# EAGLE design BaseStationV2 (EAGLE 5.07)
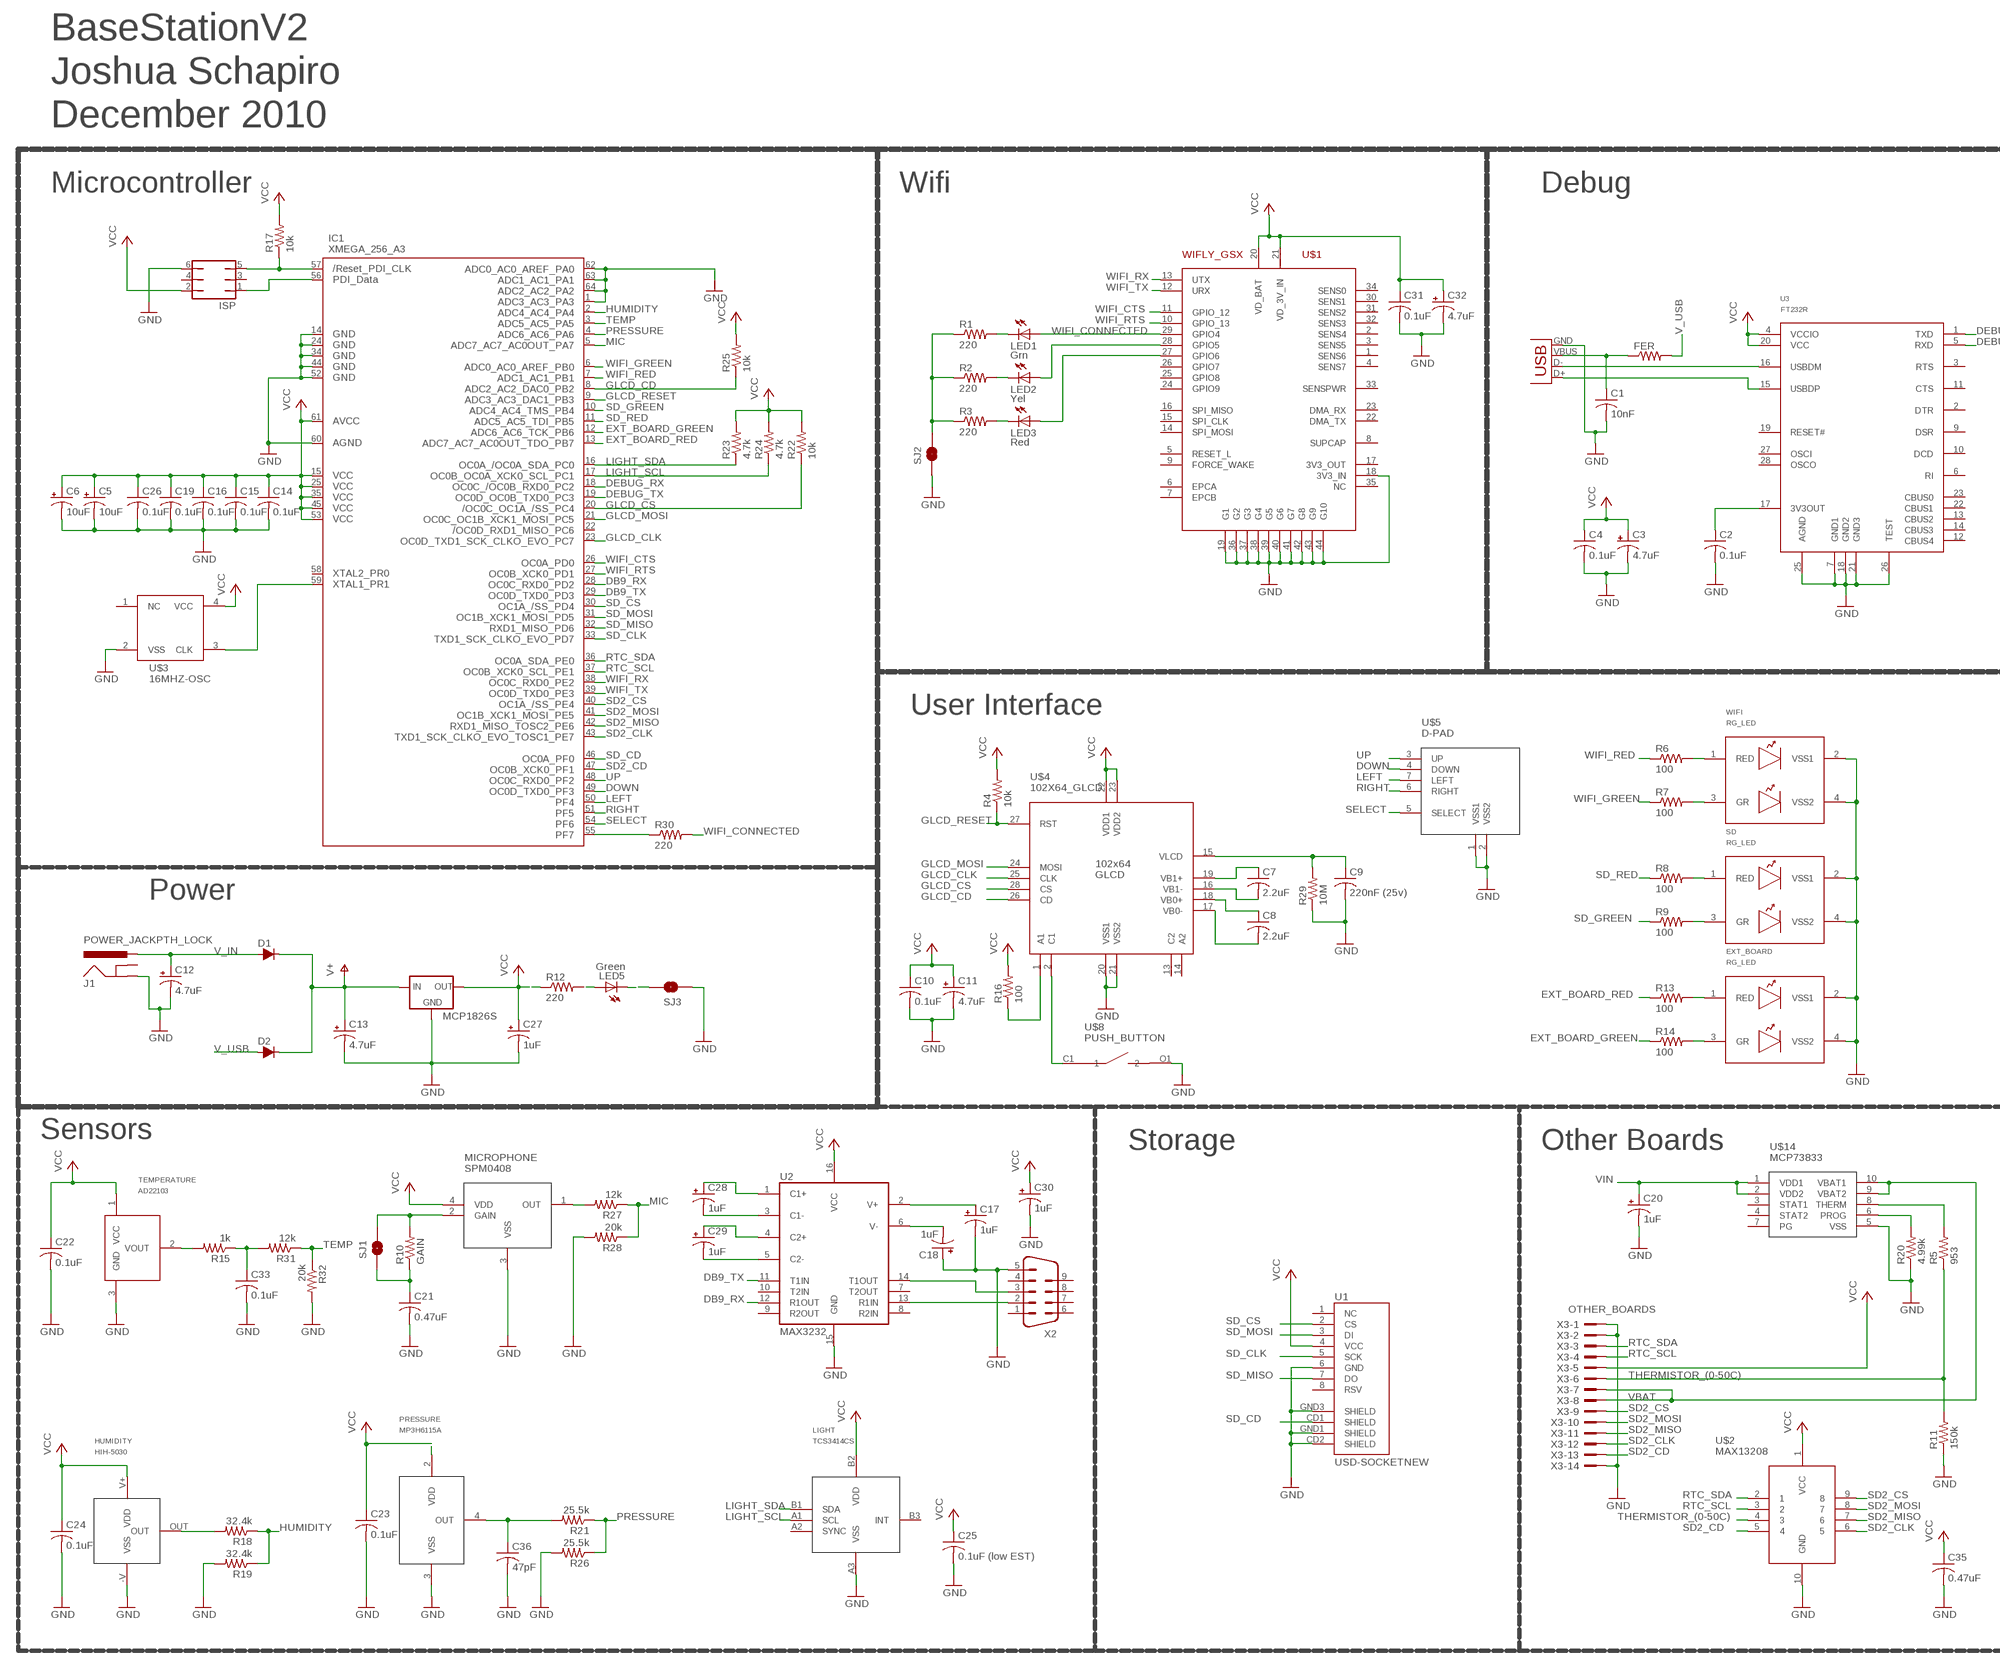
[diagram p0: schematic, sheet 1, part 1 of 2]
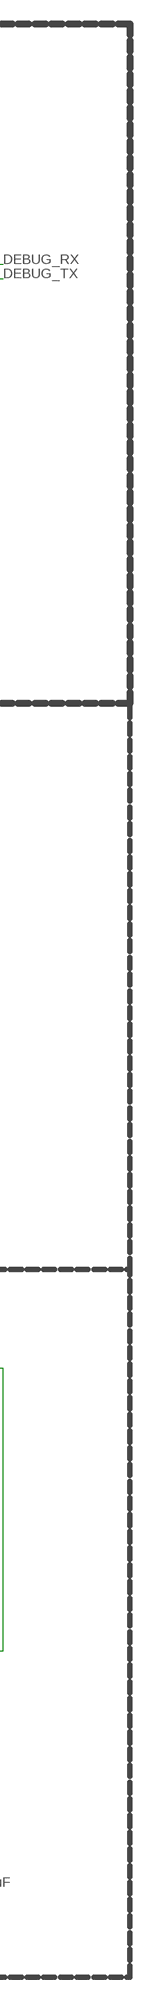
[diagram p1: schematic, sheet 1, part 2 of 2]

## Parts
C1  10nF  C-USC1206  [C1206]
C2  0.1uF  C-USC1206  [C1206]
C3  4.7uF  CPOL-USB  [PANASONIC_B]
C4  0.1uF  C-USC1206  [C1206]
C5  10uF  CPOL-USB  [PANASONIC_B]
C6  10uF  CPOL-USB  [PANASONIC_B]
C7  2.2uF  C-USC1206  [C1206]
C8  2.2uF  C-USC1206  [C1206]
C9  220nF (25v)  C-USC1206  [C1206]
C10  0.1uF  C-USC1206  [C1206]
C11  4.7uF  CPOL-USB  [PANASONIC_B]
C12  4.7uF  CPOL-USB  [PANASONIC_B]
C13  4.7uF  CPOL-USB  [PANASONIC_B]
C14  0.1uF  C-USC1206  [C1206]
C15  0.1uF  C-USC1206  [C1206]
C16  0.1uF  C-USC1206  [C1206]
C17  1uF  CPOL-USB  [PANASONIC_B]
C18  1uF  CPOL-USB  [PANASONIC_B]
C19  0.1uF  C-USC1206  [C1206]
C20  1uF  CPOL-USB  [PANASONIC_B]
C21  0.47uF  C-USC1206  [C1206]
C22  0.1uF  C-USC1206  [C1206]
C23  0.1uF  C-USC1206  [C1206]
C24  0.1uF  C-USC1206  [C1206]
C25  0.1uF (low EST)  C-USC1206  [C1206]
C26  0.1uF  C-USC1206  [C1206]
C27  1uF  CPOL-USB  [PANASONIC_B]
C28  1uF  CPOL-USB  [PANASONIC_B]
C29  1uF  CPOL-USB  [PANASONIC_B]
C30  1uF  CPOL-USB  [PANASONIC_B]
C31  0.1uF  C-USC1206  [C1206]
C32  4.7uF  CPOL-USB  [PANASONIC_B]
C33  0.1uF  C-USC1206  [C1206]
C35  0.47uF  C-USC1206  [C1206]
C36  47pF  C-USC1206  [C1206]
D1  D-FILL-SMB  [SMB]
D2  D-FILL-SMB  [SMB]
EXT_BOARD  RG_LED  [RG_LED]
FER  R-US_R0805  [R0805]
HUMIDITY  HIH-5030  [HIH-5030]
IC1  XMEGA_256_A3  AVR_XMEGA_A3_  [TQFP64]
ISP  JP3Q  [JP3Q]
J1  POWER_JACKPTH_LOCK  [POWER_JACK_PTH_LOCK]
LED1  Grn  LEDCHIPLED_1206  [CHIPLED_1206]
LED2  Yel  LEDCHIPLED_1206  [CHIPLED_1206]
LED3  Red  LEDCHIPLED_1206  [CHIPLED_1206]
LED5  Green  LEDCHIPLED_1206  [CHIPLED_1206]
LIGHT  TCS3414CS  [2X3BGA]
MCP1826S  78XXL  [78XXL]
MICROPHONE  SPM0408  [SPM0408]
PRESSURE  MP3H6115A  [1317-04]
R1  220  R-US_R1206  [R1206]
R2  220  R-US_R1206  [R1206]
R3  220  R-US_R1206  [R1206]
R4  10k  R-US_R1206  [R1206]
R5  953  R-US_R1206  [R1206]
R6  100  R-US_R1206  [R1206]
R7  100  R-US_R1206  [R1206]
R8  100  R-US_R1206  [R1206]
R9  100  R-US_R1206  [R1206]
R10  GAIN  R-US_R1206  [R1206]
R11  150k  R-US_R1206  [R1206]
R12  220  R-US_R1206  [R1206]
R13  100  R-US_R1206  [R1206]
R14  100  R-US_R1206  [R1206]
R15  1k  R-US_R1206  [R1206]
R16  100  R-US_R1206  [R1206]
R17  10k  R-US_R1206  [R1206]
R18  32.4k  R-US_R1206  [R1206]
R19  32.4k  R-US_R1206  [R1206]
R20  4.99k  R-US_R1206  [R1206]
R21  25.5k  R-US_R1206  [R1206]
R22  10k  R-US_R1206  [R1206]
R23  4.7k  R-US_R1206  [R1206]
R24  4.7k  R-US_R1206  [R1206]
R25  10k  R-US_R1206  [R1206]
R26  25.5k  R-US_R1206  [R1206]
R27  12k  R-US_R1206  [R1206]
R28  20k  R-US_R1206  [R1206]
R29  10M  R-US_R1206  [R1206]
R30  220  R-US_R1206  [R1206]
R31  12k  R-US_R1206  [R1206]
R32  20k  R-US_R1206  [R1206]
SD  RG_LED  [RG_LED]
SJ1  SOLDERJUMPERNC2  [SJ_2S-NOTRACE]
SJ2  SOLDERJUMPERNO  [SJ_2S-NO]
SJ3  SOLDERJUMPERNO  [SJ_2S-NO]
TEMPERATURE  AD22103  [TO-92]
U1  USD-SOCKETNEW  [MICRO-SD-SOCKET-PP]
U2  MAX3232  MAX232SOIC16  [SO016]
U3  FT232R  [SSOP28]
U$1  WIFLY_GSX  [WIFLY_GSX]
U$2  MAX13208  [10-UDFN]
U$3  16MHZ-OSC  [4-SMD]
U$4  102X64_GLCD  [102X64_GLCD]
U$5  D-PAD  [D-PAD]
U$8  PUSH_BUTTON  [DR6]
U$14  MCP73833  [10-MSOP]
WIFI  RG_LED  [RG_LED]
X1  USBPTH  [USB-B-PTH]
X2  M09HP  [M09HP]
X3  OTHER_BOARDS  2514-  [PAK100/2500-14]

## Nets
DB9_RX: IC1.28(PD2) U2.12(R1OUT)
DB9_TX: IC1.29(PD3) U2.11(T1IN)
DEBUG_RX: IC1.18(PC2) U3.1(TXD)
DEBUG_TX: IC1.19(PC3) U3.5(RXD)
DOWN: IC1.49(PF3) U$5.4(DOWN)
EXT_BOARD_GREEN: IC1.12(PB6) R14.1
EXT_BOARD_RED: IC1.13(PB7) R13.1
GLCD_CD: IC1.8(PB2) R25.1 U$4.26(CD)
GLCD_CLK: IC1.23(PC7) U$4.25(CLK)
GLCD_CS: IC1.20(PC4) R22.1 U$4.28(CS)
GLCD_MOSI: IC1.21(PC5) U$4.24(MOSI)
GLCD_RESET: IC1.9(PB3) R4.1 U$4.27(RST)
GND: C1.2 C2.2 C3.- C4.2 C5.- C6.- C9.2 C10.2 C11.- C12.- C13.- C14.2 C15.2 C16.2 C17.- C18.+ C19.2 C20.- C21.2 C22.2 C23.2 C24.2 C25.2 C26.2 C27.- C30.- C31.2 C32.- C33.2 C35.2 C36.2 EXT_BOARD.2(VSS1) EXT_BOARD.4(VSS2) HUMIDITY.-V(VSS) IC1.1(PA3) IC1.14(GND1) IC1.24(GND2) IC1.34(GND3) IC1.44(GND4) IC1.52(GND5) IC1.60(AGND) IC1.62(PA0) IC1.63(PA1) IC1.64(PA2) ISP.6 J1.GND LIGHT.A3(VSS) MCP1826S.GND MICROPHONE.3(VSS) PRESSURE.3(VSS) R11.1 R19.2 R20.1 R26.2 R28.2 R29.1 R32.2 SD.2(VSS1) SD.4(VSS2) SJ2.1 SJ3.1 TEMPERATURE.3(GND) U1.6(GND) U1.CD2(SHIELD) U1.GND1(SHIELD) U1.GND3(SHIELD) U2.15(GND) U3.7(GND1) U3.18(GND2) U3.21(GND3) U3.25(AGND) U3.26(TEST) U$1.18(3V3_IN) U$1.19(G1) U$1.36(G2) U$1.37(G3) U$1.38(G4) U$1.39(G5) U$1.40(G6) U$1.41(G7) U$1.42(G8) U$1.43(G9) U$1.44(G10) U$2.10(GND) U$3.2(VSS) U$4.20(VSS1) U$4.21(VSS2) U$5.1(VSS1) U$5.2(VSS2) U$8.O1 U$14.5(VSS) WIFI.2(VSS1) WIFI.4(VSS2) X1.GND X2.5 X3.1 X3.2 X3.14
HUMIDITY: IC1.2(PA4) R18.1 R19.1
LEFT: IC1.50(PF4) U$5.7(LEFT)
LIGHT_SCL: IC1.17(PC1) LIGHT.A1(SCL) R24.1
LIGHT_SDA: IC1.16(PC0) LIGHT.B1(SDA) R23.1
MIC: IC1.5(PA7) R27.1 R28.1
N$1: IC1.57(RESET) ISP.5 R17.1
N$2: IC1.56(PDI_DATA) ISP.1
N$3: LED2.A U$1.28(GPIO5)
N$4: IC1.55(PF7) R30.1
N$5: LED3.A U$1.27(GPIO6)
N$6: LED1.C R1.2
N$7: LED2.C R2.2
N$8: LED3.C R3.2
N$9: IC1.59(PR1) U$3.3(CLK)
N$10: C1.1 FER.1 X1.VBUS
N$12: U3.16(USBDM) X1.D-
N$13: U3.15(USBDP) X1.D+
N$14: C7.1 U$4.19(VB1+)
N$15: C7.2 U$4.16(VB1-)
N$16: EXT_BOARD.1(RED) R13.2
N$17: EXT_BOARD.3(GR) R14.2
N$18: C2.1 U3.17(3V3OUT)
N$19: C17.+ U2.2(V+)
N$20: U2.14(T1OUT) X2.3
N$21: C8.1 U$4.18(VB0+)
N$22: C8.2 U$4.17(VB0-)
N$23: C9.1 R29.2 U$4.15(VLCD)
N$24: C33.1 R15.1 R31.2
N$25: R5.2 U$14.8(THERM)
N$26: R8.2 SD.1(RED)
N$27: R6.2 WIFI.1(RED)
N$28: R7.2 WIFI.3(GR)
N$29: U2.13(R1IN) X2.2
N$30: R9.2 SD.3(GR)
N$31: C18.- U2.6(V-)
N$32: C21.1 R10.1 SJ1.1
N$33: MICROPHONE.2(GAIN) R10.2 SJ1.2
N$34: R1.1 R2.1 R3.1 SJ2.2
N$35: LED5.C SJ3.2
N$36: R15.2 TEMPERATURE.2(VOUT)
N$37: LED5.A R12.2
N$38: HUMIDITY.OUT R18.2
N$39: R16.1 U$4.1(A1)
N$40: C36.1 PRESSURE.4(OUT) R21.2
N$41: C28.+ U2.1(C1+)
N$42: C28.- U2.3(C1-)
N$43: C29.+ U2.4(C2+)
N$44: U$4.2(C1) U$8.C1
N$47: MICROPHONE.1(OUT) R27.2
N$49: C29.- U2.5(C2-)
N$51: R20.2 U$14.6(PROG)
PRESSURE: IC1.4(PA6) R21.1 R26.1
RIGHT: IC1.51(PF5) U$5.6(RIGHT)
RTC_SCL: IC1.37(PE1) U$2.3 X3.4
RTC_SDA: IC1.36(PE0) U$2.2 X3.3
SD2_CD: IC1.47(PF1) U$2.5 X3.13
SD2_CLK: IC1.43(PE7) U$2.6 X3.12
SD2_CS: IC1.40(PE4) U$2.9 X3.9
SD2_MISO: IC1.42(PE6) U$2.7 X3.11
SD2_MOSI: IC1.41(PE5) U$2.8 X3.10
SD_CD: IC1.46(PF0) U1.CD1(SHIELD)
SD_CLK: IC1.33(PD7) U1.5(SCK)
SD_CS: IC1.30(PD4) U1.2(CS)
SD_GREEN: IC1.10(PB4) R9.1
SD_MISO: IC1.32(PD6) U1.7(DO)
SD_MOSI: IC1.31(PD5) U1.3(DI)
SD_RED: IC1.11(PB5) R8.1
SELECT: IC1.54(PF6) U$5.5(SELECT)
TEMP: IC1.3(PA5) R31.1 R32.1
THERMISTOR_(0-50C): R5.1 R11.2 U$2.4 X3.6
UP: IC1.48(PF2) U$5.3(UP)
V+: C13.+ D1.1(C) D2.1(C) MCP1826S.IN
V_IN: C12.+ D1.2(A) J1.PWR
V_USB: D2.2(A) FER.2
VBAT: U$14.9(VBAT2) U$14.10(VBAT1) X3.7 X3.8
VCC: C3.+ C4.1 C5.+ C6.+ C10.1 C11.+ C14.1 C15.1 C16.1 C19.1 C22.1 C23.1 C24.1 C25.1 C26.1 C27.+ C30.+ C31.1 C32.+ C35.1 HUMIDITY.V+(VDD) IC1.15(VCC1) IC1.25(VCC2) IC1.35(VCC3) IC1.45(VCC4) IC1.53(VCC5) IC1.61(AVCC) ISP.2 LIGHT.B2(VDD) MCP1826S.OUT MICROPHONE.4(VDD) PRESSURE.2(VDD) R4.2 R12.1 R16.2 R17.2 R22.2 R23.2 R24.2 R25.2 TEMPERATURE.1(VCC) U1.4(VCC) U2.16(VCC) U3.4(VCCIO) U3.20(VCC) U$1.20(VD_BAT) U$1.21(VD_3V_IN) U$2.1(VCC) U$3.4(VCC) U$4.22(VDD1) U$4.23(VDD2) X3.5
VIN: C20.+ U$14.1(VDD1) U$14.2(VDD2)
WIFI_CONNECTED: LED1.A R30.2 U$1.29(GPIO4)
WIFI_CTS: IC1.26(PD0) U$1.11(GPIO_12)
WIFI_GREEN: IC1.6(PB0) R7.1
WIFI_RED: IC1.7(PB1) R6.1
WIFI_RTS: IC1.27(PD1) U$1.10(GPIO_13)
WIFI_RX: IC1.38(PE2) U$1.13(UTX)
WIFI_TX: IC1.39(PE3) U$1.12(URX)
Unconnected: IC1.22(PC6) IC1.58(PR0) ISP.3 ISP.4 J1.GNDBREAK LIGHT.A2(SYNC) LIGHT.B3(INT) U1.1(NC) U1.8(RSV) U2.7(T2OUT) U2.8(R2IN) U2.9(R2OUT) U2.10(T2IN) U3.2(DTR) U3.3(RTS) U3.6(RI) U3.9(DSR) U3.10(DCD) U3.11(CTS) U3.12(CBUS4) U3.13(CBUS2) U3.14(CBUS3) U3.19(RESET#) U3.22(CBUS1) U3.23(CBUS0) U3.27(OSCI) U3.28(OSCO) U$1.1(SENS6) U$1.2(SENS4) U$1.3(SENS5) U$1.4(SENS7) U$1.5(RESET_L) U$1.6(EPCA) U$1.7(EPCB) U$1.8(SUPCAP) U$1.9(FORCE_WAKE) U$1.14(SPI_MOSI) U$1.15(SPI_CLK) U$1.16(SPI_MISO) U$1.17(3V3_OUT) U$1.22(DMA_TX) U$1.23(DMA_RX) U$1.24(GPIO9) U$1.25(GPIO8) U$1.26(GPIO7) U$1.30(SENS1) U$1.31(SENS2) U$1.32(SENS3) U$1.33(SENSPWR) U$1.34(SENS0) U$1.35(NC) U$3.1(NC) U$4.13(C2) U$4.14(A2) U$14.3(STAT1) U$14.4(STAT2) U$14.7(PG) X2.1 X2.4 X2.6 X2.7 X2.8 X2.9

## Notes on the sheet
- BaseStationV2
- Joshua Schapiro
- December 2010
- Microcontroller | Wifi | Debug
- User Interface
- Power
- Sensors
- Storage | Other Boards

## Library data of the parts
C1 C2 C4 C7-C10 C14-C16 C19 C21-C26 C31 C33 C35 C36 = resistor:C-US: CAPACITOR, American symbol
C3 C5 C6 C11-C13 C27 C32 = gadgetry:CPOL-US: POLARIZED CAPACITOR, American symbol
C17 C18 C20 C28-C30 = resistor:CPOL-US: POLARIZED CAPACITOR, American symbol
D1 D2 = semicon-smd-ipc:D-FILL-: DIODE filled
EXT_BOARD SD WIFI = Josh:RG_LED
FER R1-R32 = resistor:R-US_: RESISTOR, American symbol
HUMIDITY = Josh:HIH-5030
IC1 = xmega:AVR_XMEGA_A3_: Device for Atmel AVR XMEGA A3 Series
ISP = jumper:JP3Q: JUMPER
J1 = SparkFun:POWER_JACK: Power Jack This is the standard 5.5mm barrel jack for power. The PTH is the most common, proven, reliable, footprint. All others are experimental. The Slot footprint only works if the mill layer is transmitted to the PCB fab house so be warned. Spark Fun Electronics SKU : PRT-00119. Mating wall wart : TOL-00298 (and others)
LED1-LED3 LED5 = led:LED: LED OSRAM: - CHIPLED LG R971, LG N971, LY N971, LG Q971, LY Q971, LO R971, LY R971 LH N974, LH R974 LS Q976, LO Q976, LY Q976 LO Q996 - Hyper CHIPLED LW Q18S LB Q993, LB Q99A, LB R99A - SideLED LS A670, LO A670, LY A670, LG A670, LP A670 LB A673, LV A673, LT A673, LW A673 LH A674 LY A675 LS A676, LA A676, LO A676, LY A676, LW A676 LS A679, LY A679, LG A679 - Hyper Micro SIDELED® LS Y876, LA Y876, LO Y876, LY Y876 LT Y87S - SmartLED LW L88C, LW L88S LB L89C, LB L89S, LG L890 LS L89K, LO L89K, LY L89K LS L896, LA L896, LO L896, LY L896 - TOPLED LS T670, LO T670, LY T670, LG T670, LP T670 LSG T670, LSP T670, LSY T670, LOP T670, LYG T670 LG T671, LOG T671, LSG T671 LB T673, LV T673, LT T673, LW T673 LH T674 LS T676, LA T676, LO T676, LY T676, LB T676, LH T676, LSB T676, LW T676 LB T67C, LV T67C, LT T67C, LS T67K, LO T67K, LY T67K, LW E67C LS E67B, LA E67B, LO E67B, LY E67B, LB E67C, LV E67C, LT E67C LW T67C LS T679, LY T679, LG T679 LS T770, LO T770, LY T770, LG T770, LP T770 LB T773, LV T773, LT T773, LW T773 LH T774 LS E675, LA E675, LY E675, LS T675 LS T776, LA T776, LO T776, LY T776, LB T776 LHGB T686 LT T68C, LB T68C - Hyper Mini TOPLED® LB M676 - Mini TOPLED Santana® LG M470 LS M47K, LO M47K, LY M47K Source: http://www.osram.convergy.de - LUMILED® LXK2-PW12-R00, LXK2-PW12-S00, LXK2-PW14-U00, LXK2-PW14-V00 LXK2-PM12-R00, LXK2-PM12-S00, LXK2-PM14-U00 LXK2-PE12-Q00, LXK2-PE12-R00, LXK2-PE12-S00, LXK2-PE14-T00, LXK2-PE14-U00 LXK2-PB12-K00, LXK2-PB12-L00, LXK2-PB12-M00, LXK2-PB14-N00, LXK2-PB14-P00, LXK2-PB14-Q00 LXK2-PR12-L00, LXK2-PR12-M00, LXK2-PR14-Q00, LXK2-PR14-R00 LXK2-PD12-Q00, LXK2-PD12-R00, LXK2-PD12-S00 LXK2-PH12-R00, LXK2-PH12-S00 LXK2-PL12-P00, LXK2-PL12-Q00, LXK2-PL12-R00 Source: www.luxeon.com
LIGHT = Josh:TCS3414CS
MCP1826S = v-reg:78XXL: VOLTAGE REGULATOR
MICROPHONE = Josh:SPM0408
PRESSURE = Josh:MP3H6115A
SJ1-SJ3 = SparkFun:SOLDERJUMPER: Solder Jumper Standard SMD solder jumper. Used to automate production. Two varients : Normally Open and Normally Closed are the same, but have different paste layers. NC will have a large amount of paste and should jumper during reflow.
TEMPERATURE = Josh:AD22103
U1 = SparkFun:USD-SOCKET: microSD Socket Push-push type uSD socket. Schematic element and footprint production proven. Spark Fun Electronics SKU : PRT-00127. tDoc lines correctly indicate media card edge positions when inserting (unlocked, locked, depressed).
U2 = SparkFun:MAX232: RS232 Transceiver Very common IC. This is generically called 'MAX232', but works with the 3V equivalent MAX3232 generic ICs. Field tested and mother approved. Spark Fun Electronics SKU : COM-00316 (DIP) and COM-00589 (SMD)
U3 = gadgetry:FT232R
U$1 = SparkFun:WIFLY_GSX
U$2 = Josh:MAX13208
U$3 = Josh:16MHZ-OSC
U$4 = Josh:102X64_GLCD
U$5 = Josh:D-PAD
U$8 = Josh:PUSH_BUTTON: digikey: 401-1995-ND
U$14 = Josh:MCP73833
X1 = SparkFun:USB: USB Connectors USB-B-PTH is fully proven SKU : PRT-00139 USB-miniB is fully proven SKU : PRT-00587 USB-A-PCB is untested. USB-A-H is throughly reviewed, but untested. Spark Fun Electronics SKU : PRT-00437 USB-B-SMT is throughly reviewed, but untested. Needs silkscreen touching up. USB-A-S has not been used/tested USB-MB-H has not been used/tested
X2 = con-subd:M09: SUB-D
X3 = con-3m:2514-: 3M (TM) Pak 100 4-Wall Header Source: 3M

## Board
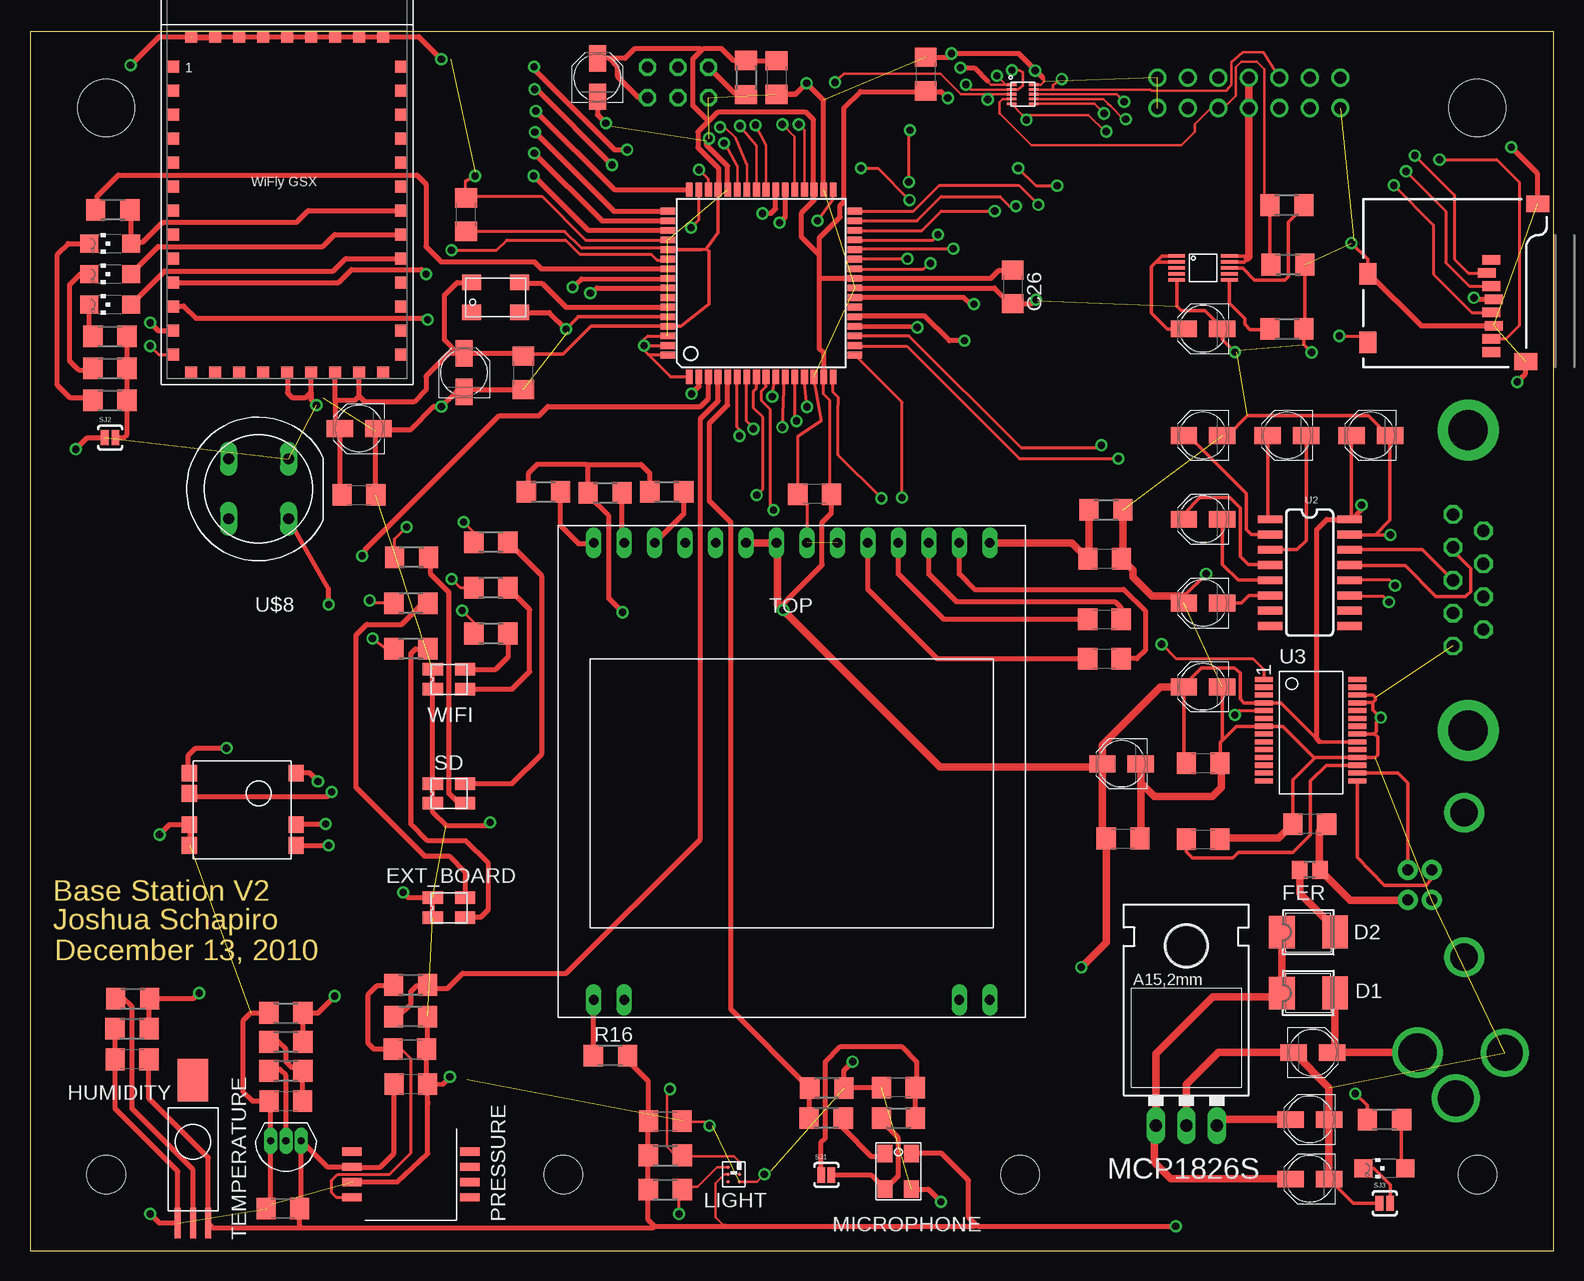
[diagram p2: board, top side]
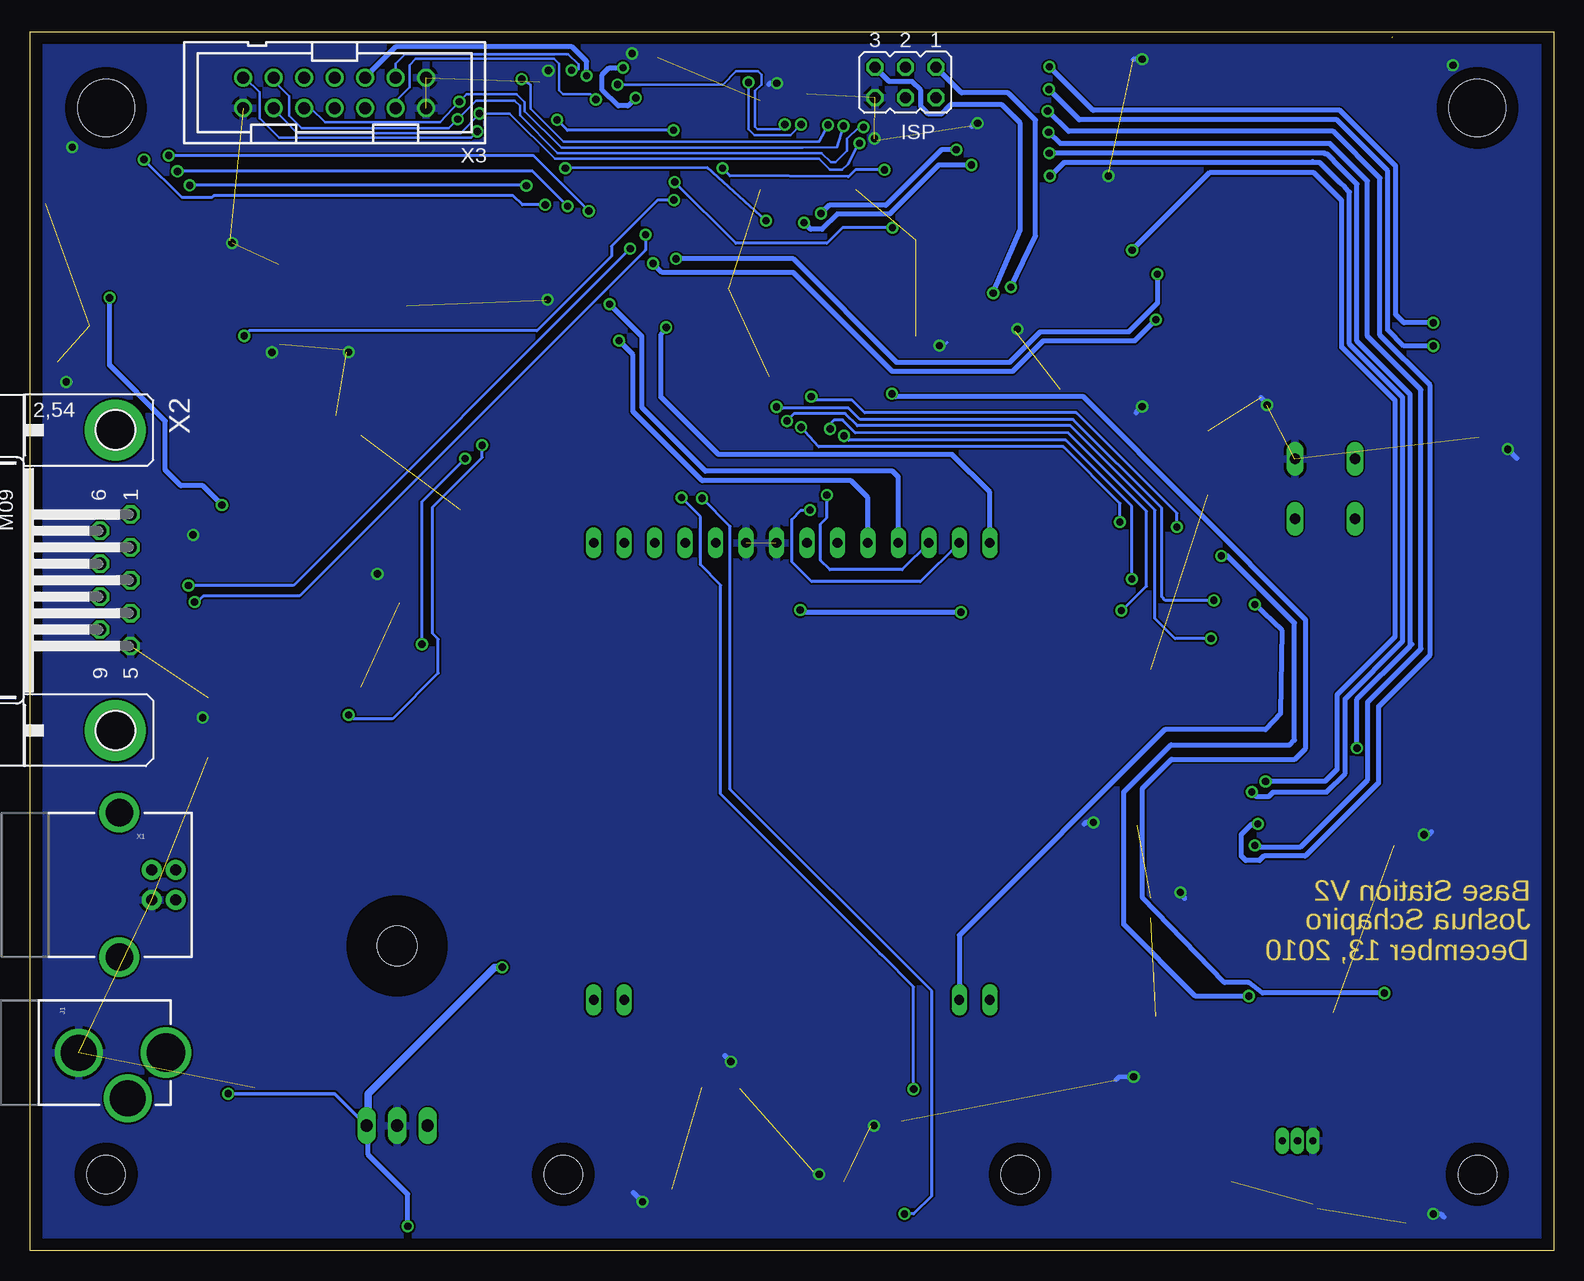
[diagram p3: board, bottom side, seen from below]

Size 127 x 101.6 mm. Coordinates in mm from the lower left corner, seen from the top.
Outline: 0,0 127,0 127,101.6 0,101.6 0,0
Copper layers (1*16): Top 0.035mm / dielectric 1.5mm / Bottom 0.035mm
Design rules "default *": minimum track width 6mil, minimum drill 15mil, track to track 6mil, track to pad 6mil, pad to pad 6mil, via to via 6mil, smd to smd 6mil, copper to edge 40mil, drill to drill 8mil, minimum pad ring 10mil, minimum via ring 8mil, stop-mask expansion 4mil, vias tented up to drill 0mil, thermal gap 10mil
Holes 3.2 mm at 6.35,6.35 120.65,6.35 82.55,6.35 44.45,6.35
Holes 4.76 mm at 6.35,95.25 120.65,95.25

### Footprints (pad centres in the part's own frame; a part is rotated, then mirrored left to right if it is on the bottom)
C1206 = smd 1.6 x 1.8: 1 -1.4,0; 2 1.4,0
PANASONIC_B = smd 2.2 x 1.4: + 1.6,0; - -1.6,0
SMB = smd 2.159 x 2.743: 1 -2.311,-0.127; 2 2.108,-0.102
RG_LED = smd 1.699 x 1.041: 1 1.35,0.825; 2 -1.35,0.825; 3 1.35,-0.825; 4 -1.35,-0.825
R0805 = smd 1.3 x 1.5: 1 -0.85,0; 2 0.85,0
HIH-5030 = smd 0.508 x 2.54: -V -1.27,-5.334; OUT 0,-5.334; V+ 1.27,-5.334 | smd 2.54 x 3.556: NC 0,6.604
TQFP64 = smd 1.194 x 0.559: 1 -7.8,6; 2 -7.8,5.2; 3 -7.8,4.4; 4 -7.8,3.6; 5 -7.8,2.8; 6 -7.8,2; 7 -7.8,1.2; 8 -7.8,0.4; 9 -7.8,-0.4; 10 -7.8,-1.2; 11 -7.8,-2; 12 -7.8,-2.8; 13 -7.8,-3.6; 14 -7.8,-4.4; 15 -7.8,-5.2; 16 -7.8,-6; 33 7.8,-6; 34 7.8,-5.2; 35 7.8,-4.4; 36 7.8,-3.6; 37 7.8,-2.8; 38 7.8,-2; 39 7.8,-1.2; 40 7.8,-0.4; 41 7.8,0.4; 42 7.8,1.2; 43 7.8,2; 44 7.8,2.8; 45 7.8,3.6; 46 7.8,4.4; 47 7.8,5.2; 48 7.8,6 | smd 0.559 x 1.194: 17 -6,-7.8; 18 -5.2,-7.8; 19 -4.4,-7.8; 20 -3.6,-7.8; 21 -2.8,-7.8; 22 -2,-7.8; 23 -1.2,-7.8; 24 -0.4,-7.8; 25 0.4,-7.8; 26 1.2,-7.8; 27 2,-7.8; 28 2.8,-7.8; 29 3.6,-7.8; 30 4.4,-7.8; 31 5.2,-7.8; 32 6,-7.8; 49 6,7.8; 50 5.2,7.8; 51 4.4,7.8; 52 3.6,7.8; 53 2.8,7.8; 54 2,7.8; 55 1.2,7.8; 56 0.4,7.8; 57 -0.4,7.8; 58 -1.2,7.8; 59 -2,7.8; 60 -2.8,7.8; 61 -3.6,7.8; 62 -4.4,7.8; 63 -5.2,7.8; 64 -6,7.8
JP3Q = drill 0.914 octagon: 1 -2.54,-1.27; 2 -2.54,1.27; 3 0,-1.27; 4 0,1.27; 5 2.54,-1.27; 6 2.54,1.27
POWER_JACK_PTH_LOCK = drill 2.997 round: GND 0.025,6.608; GNDBREAK 3.812,10.7 | drill 3.2 round: PWR 0,13.878
CHIPLED_1206 = smd 1.5 x 1.5: A 0,-1.75; C 0,1.75
2X3BGA = smd 0.3 x 0.3: A1 -0.61,0.475; A2 0,0.475; A3 0.61,0.475; B1 -0.61,-0.475; B2 0,-0.475; B3 0.61,-0.475
78XXL = drill 1.016 long: GND 0,-3.81; IN -2.54,-3.81; OUT 2.54,-3.81 | hole 3.302: 0,11.176
SPM0408 = smd 1.245 x 1.448: 1 -1.105,1.486; 2 -1.105,-1.486; 3 1.105,-1.486; 4 1.105,1.486
1317-04 = smd 1.6 x 0.686: 1 -4.915,1.905; 2 -4.915,0.635; 3 -4.915,-0.635; 4 -4.915,-1.905; 5 4.915,-1.905; 6 4.915,-0.635; 7 4.915,0.635; 8 4.915,1.905
R1206 = smd 1.6 x 1.803: 1 -1.422,0; 2 1.422,0
SJ_2S-NOTRACE = smd 0.635 x 1.27: 1 -0.45,0; 2 0.4,0
SJ_2S-NO = smd 0.635 x 1.27: 1 -0.45,0; 2 0.45,0
TO-92 = drill 0.6 long: 1 -1.27,0; 2 0,0; 3 1.27,0
MICRO-SD-SOCKET-PP = smd 0.8 x 1.5: 1 -8.94,10.7; 2 -7.84,10.3; 3 -6.74,10.7; 4 -5.64,10.9; 5 -4.54,10.7; 6 -3.44,10.9; 7 -2.34,10.7; 8 -1.24,10.7 | smd 1.8 x 1.4: CD1 -2.05,0.4; CD2 -7.75,0.4 | smd 1.4 x 1.9: GND1 -13.6,14.55; GND3 -0.45,13.55
SO016 = smd 0.66 x 2.032: 1 -4.445,-3.315; 2 -3.175,-3.315; 3 -1.905,-3.315; 4 -0.635,-3.315; 5 0.635,-3.315; 6 1.905,-3.315; 7 3.175,-3.315; 8 4.445,-3.315; 9 4.445,3.315; 10 3.175,3.315; 11 1.905,3.315; 12 0.635,3.315; 13 -0.635,3.315; 14 -1.905,3.315; 15 -3.175,3.315; 16 -4.445,3.315
SSOP28 = smd 0.425 x 1.5: 1 0.65,-1.3; 2 1.3,-1.3; 3 1.95,-1.3; 4 2.6,-1.3; 5 3.25,-1.3; 6 3.9,-1.3; 7 4.55,-1.3; 8 5.2,-1.3; 9 5.85,-1.3; 10 6.5,-1.3; 11 7.15,-1.3; 12 7.8,-1.3; 13 8.45,-1.3; 14 9.1,-1.3; 15 9.1,6.5; 16 8.45,6.5; 17 7.8,6.5; 18 7.15,6.5; 19 6.5,6.5; 20 5.85,6.5; 21 5.2,6.5; 22 4.55,6.5; 23 3.9,6.5; 24 3.25,6.5; 25 2.6,6.5; 26 1.95,6.5; 27 1.3,6.5; 28 0.65,6.5
WIFLY_GSX = smd 1 x 1: 1 0.5,26; 2 0.5,24; 3 0.5,22; 4 0.5,20; 5 0.5,18; 6 0.5,16; 7 0.5,14; 8 0.5,12; 9 0.5,10; 10 0.5,8; 11 0.5,6; 12 0.5,4; 13 0.5,2; 14 2,0.5; 15 4,0.5; 16 6,0.5; 17 8,0.5; 18 10,0.5; 19 12,0.5; 20 14,0.5; 21 16,0.5; 22 18,0.5; 23 19.5,2; 24 19.5,4; 25 19.5,6; 26 19.5,8; 27 19.5,10; 28 19.5,12; 29 19.5,14; 30 19.5,16; 31 19.5,18; 32 19.5,20; 33 19.5,22; 34 19.5,24; 35 19.5,26; 36 18,28.5; 37 16,28.5; 38 14,28.5; 39 12,28.5; 40 10,28.5; 41 8,28.5; 42 6,28.5; 43 4,28.5; 44 2,28.5
10-UDFN = smd 0.8 x 0.22: 1 -0.91,0.8; 2 -0.91,0.4; 3 -0.91,0; 4 -0.91,-0.4; 5 -0.91,-0.8; 6 0.91,-0.8; 7 0.91,-0.4; 8 0.91,0; 9 0.91,0.4; 10 0.91,0.8
4-SMD = smd 1.6 x 1.3: 1 -2,-1.25; 2 2,-1.25; 3 2,1.25; 4 -2,1.25
102X64_GLCD = drill 0.8 long: 1 -16.51,-17.2; 2 -13.97,-17.2; 13 13.97,-17.2; 14 16.51,-17.2; 15 16.51,20.9; 16 13.97,20.9; 17 11.43,20.9; 18 8.89,20.9; 19 6.35,20.9; 20 3.81,20.9; 21 1.27,20.9; 22 -1.27,20.9; 23 -3.81,20.9; 24 -6.35,20.9; 25 -8.89,20.9; 26 -11.43,20.9; 27 -13.97,20.9; 28 -16.51,20.9
D-PAD = smd 1.27 x 1.397: 1 -5.757,-4.318; 2 -5.757,-2.591; 3 3.141,-2.591; 4 3.141,-4.318; 5 3.141,1.702; 6 -5.757,0; 7 -5.757,1.702
DR6 = drill 0.9 long: C1 -2.5,2.5; C2 2.5,2.5; O1 -2.5,-2.5; O2 2.5,-2.5
10-MSOP = smd 0.3 x 1.4: 1 -1,-2.2; 2 -0.5,-2.2; 3 0,-2.2; 4 0.5,-2.2; 5 1,-2.2; 6 1,2.2; 7 0.5,2.2; 8 0,2.2; 9 -0.5,2.2; 10 -1,2.2
USB-B-PTH = drill 0.914 pad 1.676 round: D+ 0,1.25; D- 1.981,1.25; GND 0,-1.25; VBUS 1.981,-1.25 | drill 2.286 round: P$1 -2.718,-6.02; P$2 -2.718,6.02
M09HP = drill 1.016 octagon: 1 -5.486,1.27; 2 -2.743,1.27; 3 0,1.27; 4 2.743,1.27; 5 5.486,1.27; 6 -4.115,-1.27; 7 -1.372,-1.27; 8 1.372,-1.27; 9 4.115,-1.27 | drill 3.302 pad 5.08 round: G1 -12.522,0; G2 12.522,0
PAK100/2500-14 = drill 1 pad 1.422 round: 1 -7.62,-1.27; 2 -7.62,1.27; 3 -5.08,-1.27; 4 -5.08,1.27; 5 -2.54,-1.27; 6 -2.54,1.27; 7 0,-1.27; 8 0,1.27; 9 2.54,-1.27; 10 2.54,1.27; 11 5.08,-1.27; 12 5.08,1.27; 13 7.62,-1.27; 14 7.62,1.27

### Placement (x,y rotation side)
C1  106.68,35.56 180 top
C2  97.79,34.29 0 top
C3  97.79,46.99 180 top
C4  97.79,40.64 0 top
C5  36.2,73.18 90 top
C6  47.31,97.79 90 top
C7  89.56,49.35 0 top
C8  89.56,52.63 0 top
C9  89.59,57.68 0 top
C10  91.11,34.35 0 top
C11  91,40.58 180 top
C12  106.93,16.51 0 top
C13  106.68,5.97 180 top
C14  65.41,63.06 180 top
C15  41.11,73.17 270 top
C16  36.35,86.36 90 top
C17  97.79,67.94 180 top
C18  97.79,53.98 180 top
C19  62.23,97.78 270 top
C20  97.79,76.83 180 top
C21  72.39,13.59 180 top
C22  21.08,3.49 180 top
C23  31.75,13.89 0 top
C24  8.51,15.94 180 top
C25  52.96,10.79 0 top
C26  81.92,80.33 270 top
C27  106.68,10.92 180 top
C28  104.78,67.94 180 top
C29  97.79,60.96 180 top
C30  111.76,67.94 180 top
C31  27.43,62.99 0 top
C32  27.43,68.52 180 top
C33  21.34,12.45 180 top
C35  74.68,98.07 90 top
C36  31.67,16.79 0 top
D1  106.68,21.59 0 top
D2  106.68,26.67 0 top
EXT_BOARD  34.92,28.57 0 top
FER  106.68,31.75 180 top
HUMIDITY  13.59,7.62 0 top
IC1  60.96,80.64 90 top
ISP  54.03,97.38 180 bottom
J1  129.54,16.51 270 bottom
LED1  6.67,83.95 90 top
LED2  6.67,81.41 90 top
LED3  6.67,78.87 90 top
LED5  112.9,6.86 90 top
LIGHT  58.67,6.35 270 top
MCP1826S  96.39,14.22 0 top
MICROPHONE  72.39,6.6 0 top
PRESSURE  31.75,6.35 0 top
R1  6.67,70.87 180 top
R2  6.67,73.53 180 top
R3  6.67,76.2 180 top
R4  47.94,63.18 180 top
R5  104.78,87.15 0 top
R6  38.42,51.44 0 top
R7  38.42,55.24 0 top
R8  38.42,59.05 0 top
R9  31.81,57.78 0 top
R10  72.39,11.05 180 top
R11  104.85,82.19 180 top
R12  112.9,10.92 0 top
R13  31.75,53.98 0 top
R14  31.75,50.16 0 top
R15  21.34,14.99 180 top
R16  48.39,16.26 0 top
R17  59.69,97.79 90 top
R18  8.56,21.01 180 top
R19  8.51,18.52 180 top
R20  104.78,76.83 180 top
R21  31.72,22.15 180 top
R22  42.8,63.25 180 top
R23  52.96,5.08 180 top
R24  52.96,7.94 180 top
R25  53.09,63.25 180 top
R26  31.72,19.51 0 top
R27  66.37,11.05 0 top
R28  66.42,13.54 0 top
R29  89.69,61.75 180 top
R30  6.91,86.77 0 top
R31  21.34,17.4 180 top
R32  21.34,19.81 180 top
SD  34.92,38.1 0 top
SJ1  66.4,6.3 0 top
SJ2  6.68,67.77 0 top
SJ3  112.93,3.94 0 top
TEMPERATURE  21.34,9.14 180 top
U1  111.12,73.66 270 top
U2  106.68,56.52 270 top
U3  104.14,48.26 270 top
U$1  11.43,72.71 0 top
U$2  82.75,96.39 0 top
U$3  38.81,79.45 0 top
U$4  63.5,38.1 0 top
U$5  19.05,38.1 0 top
U$8  19.05,63.5 180 top
U$14  97.79,81.92 270 top
WIFI  34.92,47.62 0 top
X1  116.84,30.48 0 bottom
X2  119.89,55.88 270 bottom
X3  101.6,96.52 180 bottom

### Tracks (layer width: path | path; a pad name or v marks a point on that pad's centre or on a via)
DB9_RX  (via drill 0.6)
  Top 0.254: U2.12 113.36,55.88 v113.79,55.45 | 68.64,83.44 68.58,83.39 | IC1.28 68.64,83.44 | v76.96,83.52 68.71,83.52 68.64,83.44
  Bottom 0.254: v113.79,55.45 105.03,55.45 v76.96,83.52
DB9_TX  (via drill 0.6)
  Top 0.254: IC1.29 75.25,84.25 v75.69,84.68 | 109.89,54.51 109.86,54.51 | 109.89,54.51 U2.11 | v113.28,54.08 112.85,54.51 109.89,54.51
  Bottom 0.254: v75.69,84.68 75.69,83.41 104.52,54.59 112.55,54.59 113.06,54.08 v113.28,54.08
DEBUG_RX  (via drill 0.6)
  Top 0.254: U3.1 102.84,48.44 101.93,49.35 95.53,49.35 v94.34,50.55 | v90.73,66.02 82.47,66.02 73.1,75.39 68.91,75.39 68.85,75.44 IC1.18
  Bottom 0.254: v94.34,50.55 94.34,62.41 v90.73,66.02
DEBUG_TX  (via drill 0.6)
  Top 0.254: IC1.19 73.28,76.25 82.65,66.88 89.05,66.88 v89.31,67.13 | U3.5 102.82,45.03 100.81,45.03 v100.43,44.65
  Bottom 0.254: v89.31,67.13 89.31,66.12 93.45,61.98 93.45,51.46 92.96,50.98 92.96,48.13 96.77,44.32 100.1,44.32 v100.43,44.65
DOWN  (via drill 0.6)
  Top 0.406: IC1.49 48.69,86.64 v42.09,93.24 | U$5.4 v24.89,33.78
  Bottom 0.406: v42.09,93.24 41.12,92.28 18.64,92.28 15.52,89.15 15.52,76.22 11.05,71.75 11.05,50.16 15.49,45.72 15.49,39.24 21.08,33.66 24.77,33.66 v24.89,33.78
EXT_BOARD_GREEN  (via drill 0.6)
  Top 0.254: R14.1 29.72,50.16 v28.55,51.03 | v63.91,69.16 63.91,69.44 63.75,69.6 63.75,72.69 63.83,72.77 IC1.12
  Bottom 0.254: v28.55,51.03 31.55,51 33.22,52.68 33.22,61.72 40.26,68.76 58.04,68.76 59.05,69.77 63.3,69.77 v63.91,69.16
EXT_BOARD_RED  (via drill 0.6)
  Top 0.254: R13.1 28.55,53.98 v28.32,54.2 | 64.59,72.84 64.59,72.85 | 64.59,72.84 IC1.13 | v64.77,70.33 64.54,72.8 64.59,72.84
  Bottom 0.254: v28.32,54.2 32.38,54.2 32.66,54.48 32.66,61.9 40.06,69.29 57.81,69.29 58.75,70.23 64.24,70.23 v64.77,70.33
GLCD_CD  (via drill 0.6)
  Top 0.254: IC1.8 60.56,71.86 60.33,71.63 60.33,70.23 61.09,69.47 61.09,63.5 v60.58,62.99
  Top 0.406: R25.1 54.51,61.44 U$4.26
  Bottom 0.254: v60.58,62.99 60.58,61.09 61.09,60.58 61.09,57.53 60.33,56.77 54.3,56.77 U$4.26
GLCD_CLK  (via drill 0.6)
  Top 0.406: v78.69,78.89 78.38,78.89 77.83,79.45 68.89,79.45 68.86,79.48 68.83,79.44 IC1.23
  Bottom 0.406: U$4.25 54.61,64.49 55.09,64.97 70.69,64.97 76,70.28 76,76.2 v78.69,78.89
GLCD_CS  (via drill 0.6)
  Top 0.406: IC1.20 68.73,77.01 v73.97,76.96 | R22.1 44.22,60.43 45.72,58.93 46.92,58.93 U$4.28
  Bottom 0.406: U$4.28 46.99,63.22 50.14,66.37 69.62,66.37 74.4,71.14 74.4,76.35 v73.97,76.96
GLCD_MOSI  (via drill 0.6)
  Top 0.406: v77.9,75.84 76.63,75.84 74.57,77.9 68.99,77.9 68.93,77.84 IC1.21
  Bottom 0.406: U$4.24 57.15,62.76 58.57,64.19 70.97,64.19 76.73,69.95 76.73,74.68 v77.9,75.84
GLCD_RESET  (via drill 0.6)
  Top 0.254: IC1.9 61.36,72.03 60.96,71.63 60.96,70.87 61.72,70.1 61.72,61.98 v61.98,61.72
  Top 0.406: U$4.27 49.53,59.03 49.36,59.2 R4.1
  Bottom 0.254: v61.98,61.72 62.74,61.72 63.5,60.96 63.5,57.4 61.85,55.75 52.78,55.75 U$4.27
GND  (via drill 0.6)  (41 unrouted)
  Top 0.203: U$2.10 84.29,97.19 84.53,97.43 84.53,97.64 | 84.53,97.64 84.53,97.66 84.43,97.77 | 84.53,97.64 v83.8,98.37 | LIGHT.A3 60.6,5.74 v61.21,6.35 | 54.51,10.72 56.34,10.72 v56.64,10.41
  Top 0.254: C25.2 54.43,10.79 54.51,10.72 | IC1.52 46.31,84.25 42.67,87.88 36.83,87.88 36.58,87.63 36.45,87.76 C16.2 36.3,89.16 v37.11,89.59 | IC1.14 65.36,72.74 65.38,72.72 65.35,72.69 65.96,69.19 64,67.89 C14.2 64.82,62.24 64.82,59 U$4.21 | IC1.62 51.48,76.25 51.18,75.95 v51.18,75.44 | 51.56,74.68 51.18,75.06 v51.18,75.44 | 51.56,74.68 53.13,74.68 IC1.64 | IC1.63 v51.19,75.44 v51.18,75.44 | IC1.1 53.39,72.84 51.56,74.68
  Top 0.305: C1.2 105.28,39.24 107.14,41.1 | 107.14,41.1 110.69,41.1 110.68,41.11 U3.18 112.13,41.11 112.34,41.33 112.34,42.8 112.08,43.06 112.02,43.06 | 99.29,42.42 99.21,42.34 99.21,40.72 99.14,40.64 C4.2 | 99.29,42.42 100.58,43.71 U3.7 102.79,43.71 102.77,43.69 104.42,43.69 107.01,41.1 107.14,41.1 | 99.29,42.42 99.26,42.44 99.39,42.57 C3.- | U3.26 111.93,46.31 112.14,46.1 112.14,45.9 111.94,45.7 | U3.25 110.62,45.64 | U3.25 | 111.94,45.7 110.67,45.7 U3.25 | 112.02,43.06 U3.21 | 112.02,43.06 112.24,43.28 112.24,44.07 v112.6,44.42 111.94,45.09 111.94,45.7 | 112.14,59.66 113.36,60.88 C30.- 113.23,67.94 111.58,69.6 101.5,69.6 99.85,67.94 C17.- | U2.15 110.01,59.69 110.03,59.72 110.08,59.66 112.14,59.66 | C18.+ 96.19,54.56 v98.04,56.41 | 112.14,59.66 v113.41,59.66 | v44.68,76.81 45.55,77.69 | 45.55,77.69 45.71,77.84 | 45.55,77.69 45.54,77.7 45.69,77.84 IC1.60 | U$14.5 95.59,78.73 95.96,78.36 97.92,78.36 99.39,76.89 C20.- 99.39,75.95 v100.43,74.91 | v106.83,74.88 106.2,75.52 R20.1 106.25,76.83 106.3,76.89 106.27,76.91 R11.1 | U1.CD2 111.53,82.63 v110.16,84 | SJ3.1 110.31,3.94 C13.-
  Top 0.406: C23.2 34.42,13.87 v35,14.48 | v83.84,79.27 83.5,78.93 C26.2 81.73,78.93 80.41,80.25 IC1.24 | C15.2 36.47,71.77 36.28,71.58 C5.- 35.52,71.58 v34.29,70.36 33.66,70.36 31.75,68.45 29.1,68.45 C32.- 28.83,68.32 C31.2 | U$1.43 15.36,101.21 15.24,101.09 15.12,101.21 | 17.43,101.19 17.53,101.09 | 17.43,101.19 U$1.42 U$1.41 | 17.43,101.19 17.41,101.21 U$1.43 | U$1.41 19.44,101.21 19.56,101.09 | U$1.41 U$1.40 | U$1.40 21.47,101.21 21.59,101.09 | U$1.40 U$1.39 | U$1.39 23.48,101.21 23.62,101.35 | U$1.39 25.29,101.21 25.4,101.09 25.43,101.12 U$1.38 27.29,101.21 27.43,101.34 | 27.43,101.34 27.43,101.35 | 27.43,101.34 U$1.37 U$1.36 | U$1.36 29.6,101.21 29.72,101.09 | U$1.36 32.4,101.21 v34.29,99.31 | U$1.44 10.78,101.21 v8.38,98.81 | U$1.43 13.58,101.21 13.46,101.09 15.49,101.09 15.43,101.16 U$1.43 | C6.- 47.31,94.68 v48.01,93.98 | 63.79,96.38 C19.2 63.82,96.38 v64.75,97.31 66.16,95.89 IC1.34 66.17,88.45 | C35.2 76.48,99.47 v76.81,99.8 82.4,99.8 84.43,97.77 | IC1.44 58.16,90.41 56.41,92.15 56.41,92.51 v56.62,92.71 | U1.CD2 111.53,81.43 111.58,81.48 115.97,77.1 U1.6 | U1.GND3 124.67,73.11 v123.98,72.42 | U1.GND1 125.67,89.77 v123.47,91.97 | PRESSURE.3 30.61,5.71 33.15,8.1 33.15,12.22 33.15,12.37 C23.2 | MICROPHONE.3 74.89,5.12 v75.95,4.06 | C21.2 67.89,13.59 R28.2 67.84,15.01 v68.58,15.75 | C23.2 33.07,13.97 C36.2 33.15,16.86 R26.2 | SJ2.1 4.78,67.77 v3.81,66.8 | U$3.2 43.29,78.2 v44.68,76.81 | EXT_BOARD.4 EXT_BOARD.2 31.56,29.4 v31.11,29.84 | WIFI.2 WIFI.4 SD.2 SD.4 33.58,36.53 34.67,35.43 38.1,35.43 v38.35,35.69 | U$5.1 U$5.2 11.63,35.51 v10.79,34.67 | C22.2 20.07,3.88 TEMPERATURE.3 20.07,12.32 C33.2 18.54,12.45 17.78,13.21 17.78,19.18 18.41,19.81 R32.2
  Top 0.406: R19.2 7.09,15.96 C24.2 7.11,11.81 12.32,6.6 HUMIDITY.-V 10.79,2.29 v10.03,3.05 | 23.43,71.56 U$1.19 | 23.43,71.56 22.99,71.12 21.84,71.12 21.46,71.5 21.46,73.17 U$1.18 | 23.43,71.56 23.43,70.93 v23.88,70.48
  Top 0.61: C12.- 105.08,16.51 | C2.2 99.16,34.32 99.16,34.39 104.11,34.39 C1.2 | R29.1 91.11,57.81 C9.2 91.95,56.72 91.95,56.13 93.52,54.56 96.19,54.56 | C10.2 92.6,34.44 C11.- 92.6,38.98 93.73,37.85 98.55,37.85 99.31,38.61 99.31,40.52 C4.2 | MCP1826S.GND 96.39,13.84 99.06,16.51 C12.- | C13.- C27.- 108.28,13.56 C12.-
  Bottom 0.203: v83.8,98.37 83.95,98.22 | v61.21,6.35 61.47,6.35 61.72,6.6 | v56.64,10.41 56.9,10.41
  Bottom 0.254: v37.11,89.59 37.08,89.92 37.34,89.66 | v51.18,75.44 50.8,75.44 50.55,75.69
  Bottom 0.305: v112.6,44.42 112.78,44.42 112.83,44.37 | v98.04,56.41 98.04,56.46 97.84,56.67 | v113.41,59.66 113.41,59.82 113.59,59.99 | v44.68,76.81 44.68,76.78 44.86,76.61 | v100.43,74.91 100.61,74.91 100.79,75.08 | v106.83,74.88 107.01,74.88 107.11,74.98 | v110.16,84 110.36,84.2
  Bottom 0.406: v35,14.48 36.27,14.43 36.45,14.25 | v83.84,79.27 83.9,79.27 84,79.17 | v34.29,70.36 34.8,69.85 | v34.29,99.31 35.05,99.31 | v8.38,98.81 8.64,98.55 | v48.01,93.98 48.26,93.98 48.51,93.73 | v64.75,97.31 65.33,97.31 65.41,97.23 | v76.81,99.8 77.04,99.8 77.14,99.69 | v56.62,92.71 56.69,92.71 56.77,92.63 | v123.98,72.42 123.62,72.42 | v123.47,91.97 123.55,91.97 123.7,92.13 | v75.95,4.06 76.71,4.83 | v68.58,15.75 69.09,16.26 | v3.81,66.8 3.05,66.04 | v31.11,29.84 31.11,29.72 30.73,29.34 | v38.35,35.69 38.99,35.69 39.12,35.56 | v10.79,34.67 10.41,34.67 10.16,34.92 | v10.03,3.05 9.4,3.05 9.14,2.79 | v23.88,70.48 23.88,70.61 24.38,71.12
  pour Bottom: 0,101.6 127,101.6 127,0 0,0
HUMIDITY  (via drill 0.6)
  Top 0.406: 55.78,72.86 55.78,73.05 | 55.78,72.86 IC1.2 | v55.14,71.42 55.78,72.06 55.78,72.86 | R19.1 9.93,20.95 R18.1 13.64,21.01 v14.1,21.46
  Bottom 0.406: v55.14,71.42 55.12,71.42 54.86,71.17 39.17,71.17 20.65,52.58 20.65,41.86 21.57,40.95 31.85,40.95 34.27,38.53 34.27,29.44 27.43,22.35 25.4,22.35 24.26,21.46 v14.1,21.46
LEFT  (via drill 0.6)
  Top 0.406: IC1.50 47.68,85.84 v42.04,91.49 | v16.38,41.88 13.82,41.88 13.21,41.27 13.21,39.89 U$5.7
  Bottom 0.406: v42.04,91.49 19.1,91.49 19.02,91.42 18.87,91.42 18.31,90.86 18.31,90.83 16.38,88.9 16.38,75.82 11.94,71.37 11.94,50.42 | v16.38,41.88 16.38,45.97 12.19,50.16 11.94,50.42 | 11.94,50.42 11.81,50.55
LIGHT_SCL  (via drill 0.6)
  Top 0.203: LIGHT.A1 59.15,7.4 58.67,7.87 54.44,7.87 R24.1 53.78,7.94 53.09,8.64 53.09,13.21 v53.34,13.46
  Top 0.254: IC1.17 72.69,70.71 v72.69,62.76
  Bottom 0.254: v72.69,62.76 71.12,61.19 71.12,57.17 69.42,55.47 69.42,38.05 56.2,24.83 55.96,24.59 53.34,21.97 v53.34,13.46
LIGHT_SDA  (via drill 0.6)
  Top 0.203: LIGHT.B1 57.25,6.96 55.63,5.33 54.63,5.33 R23.1
  Top 0.254: v70.97,62.71 67.36,66.32 67.36,70.48 67.39,70.51 67.39,71.12 66.95,71.55 IC1.16 | v54.1,3.05 54.1,4.8 R23.1
  Bottom 0.254: v70.97,62.71 68.63,60.38 68.63,38.46 51.82,21.64 51.82,4.57 53.34,3.05 v54.1,3.05
MIC
  Top 0.406: R27.1 65,11.1 R28.1 58.42,20.12 58.42,60.71 56.64,62.48 56.64,68.96 58.16,70.48 IC1.5
N$1  (via drill 0.6)
  Top 0.406: R17.1 59.69,96.52 58.7,96.52 ISP.5 | IC1.57 47.26,80.25 v46.71,79.81
  Bottom 0.406: ISP.5 55.37,97.46 53.47,97.46 52.73,96.72 52.73,95.38 52.09,94.74 51.05,94.74 50.29,95.5 45.97,95.5 44.45,93.98 44.45,85.09 v46.71,79.81
N$2  (via drill 0.6)
  Top 0.406: 53.34,81.03 53.32,81.05 IC1.56 53.1,81.05 53.09,81.03 45.97,81 v45.24,80.31
  Bottom 0.406: v45.24,80.31 43.18,84.58 43.18,94.23 45.47,96.52 49.35,96.52 ISP.1
N$3
  Top 0.406: LED2.A 8.42,81.44 10.67,83.69 24.38,83.69 25.4,84.71 U$1.28
N$4
  Top 0.406: IC1.55 42.62,81.84 42.04,82.42 34.29,82.42 33.02,83.69 33.02,88.9 32.26,89.66 7.37,89.66 5.59,87.88 5.59,86.87 R30.1
N$5
  Top 0.406: LED3.A 11.21,81.66 25.27,81.66 26.32,82.71 U$1.27
N$6
  Top 0.406: LED1.C 3.17,83.95 2.29,83.06 2.29,72.14 3.3,71.12 4.99,71.12 R1.2
N$7
  Top 0.406: LED2.C 4.19,81.41 3.3,80.52 3.3,74.17 4.06,73.41 5.12,73.41 R2.2
N$8
  Top 0.406: LED3.C 4.92,76.53 R3.2
N$9
  Top 0.406: IC1.59 44.67,78.64 42.67,80.64 40.87,80.64 U$3.3
N$10
  Top 0.61: 114.88,29.21 114.91,29.21 | 114.88,29.21 X1.VBUS | 114.88,29.21 110.07,29.21 FER.1 107.48,31.7 107.47,31.7 107.47,34.95 C1.1
N$12
  Top 0.305: U3.16 114.01,39.81 114.83,38.99 114.83,31.73 | 114.83,31.73 114.84,31.73 X1.D- | 114.83,31.73 114.81,31.7
N$13
  Top 0.305: U3.15 110.64,32.79 112.88,30.43 116.38,30.43 116.84,31.01 116.84,31.67 116.86,31.7 X1.D+
N$14
  Top 0.406: C7.1 75.62,49.35 69.85,55.12 U$4.19
N$15
  Top 0.406: C7.2 92.28,49.35 92.96,50.04 92.96,53.34 91.19,55.12 78.74,55.12 77.47,56.39 U$4.16
N$16
  Top 0.406: EXT_BOARD.1 36.27,31.54 34.92,32.89 32.89,32.89 27.18,38.61 27.18,51.31 28.07,52.2 30.99,52.2 32.77,53.98 R13.2
N$17
  Top 0.406: R14.2 32.13,50.16 31.75,49.78 31.75,35.56 33.15,34.16 36.32,34.16 38.23,32.26 38.23,28.45 37.59,27.81 36.34,27.81 EXT_BOARD.3
N$18
  Top 0.305: U3.17 108.05,40.46 106.73,39.14 106.73,34.65 105.26,33.17 100.71,33.17 100.25,32.72 96.9,32.72 96.39,33.22 96.39,34.39 | 96.39,34.39 C2.1 | 96.39,34.39 96.42,34.42
N$19
  Top 0.305: C17.+ 96.57,67.94 101.4,63.12 101.4,60.1 101.8,59.69 103.33,59.69 103.35,59.72 103.36,59.7 U2.2
N$20
  Top 0.305: U2.14 116.08,58.42 X2.3
N$21
  Top 0.406: C8.1 76.15,52.63 72.39,56.39 U$4.18
N$22
  Top 0.406: C8.2 90.96,53.57 90.42,54.1 77.22,54.1 74.93,56.39 U$4.17
N$23
  Top 0.61: U$4.15 86.87,59 C9.1 88.27,57.76 R29.2
N$24
  Top 0.406: C33.1 22.74,14.96 R15.1 22.5,15.24 21.84,15.24 21.34,15.75 21.34,16.76 20.7,17.4 R31.2
N$25
  Top 0.305: U$14.8 101.09,81.92 102.06,80.9 104.62,80.9 104.88,81.2 104.88,85.72 106.22,87.07 106.2,87.1 R5.2
N$26
  Top 0.406: SD.1 40.2,38.92 42.67,41.4 42.67,56.22 R8.2
N$27
  Top 0.406: WIFI.1 38.8,48.45 39.88,49.53 39.88,51.4 R6.2
N$28
  Top 0.406: WIFI.3 40.2,46.8 41.66,48.26 41.66,53.43 R7.2
N$29
  Top 0.305: U2.13 110.92,57.15 110.97,57.1 114.66,57.1 117.2,54.51 119.63,54.51 120.09,54.94 120.09,56.87 118.44,58.52 118.57,58.65 X2.2
N$30
  Top 0.406: SD.3 35.75,37.27 34.92,38.1 34.92,54.86 33.4,56.39 33.4,57.62 R9.2
N$31
  Top 0.305: C18.- 100.97,53.98 101.6,54.61 103.28,54.61 103.3,54.59 103.33,54.61 U2.6
N$32
  Top 0.406: R10.1 73.79,11.07 C21.1 73.91,13.71 73.91,15.75 72.64,17.02 67.56,17.02 66.29,15.75 66.29,9.4 65.95,9.05 SJ1.1
N$33
  Top 0.406: R10.2 70.97,10.82 72.39,9.4 72.39,6.22 MICROPHONE.2 70.1,6.3 SJ1.2
N$34
  Top 0.406: R3.1 R2.1 R1.1 8.09,68.03 7.82,67.77 SJ2.2
N$35
  Top 0.305: LED5.C 112.01,6.86 113.41,5.46 113.41,3.97 SJ3.2
N$36
  Top 0.406: TEMPERATURE.2 21.34,14.61 20.83,15.11 20.04,15.11 R15.2
N$37
  Top 0.305: R12.2 114.33,7.19 LED5.A
N$38
  Top 0.406: HUMIDITY.OUT 13.59,6.73 8.51,11.81 8.51,20.32 7.75,21.08 7.21,21.08 R18.2
N$39
  Top 0.406: R16.1 46.97,20.88 U$4.1
N$40
  Top 0.254: PRESSURE.4 25.53,4.45 25.15,4.83 25.15,5.84 25.65,6.35 29.97,6.35 31.75,8.13 31.75,16 30.99,16.76 30.3,16.76 C36.1
  Top 0.406: C36.1 28.68,16.79 28.19,17.27 28.19,21.34 28.96,22.1 30.25,22.1 R21.2
N$41
  Top 0.305: U2.1 103.45,60.96 103.48,60.98 103.17,61.29 C28.+
N$42
  Top 0.305: C28.- 106.38,59.21 105.61,58.45 103.38,58.45 103.36,58.46 | 103.36,58.46 103.25,58.57 | U2.3 103.36,58.46
N$43
  Top 0.305: C29.+ 96.19,61.42 97.54,62.76 100.03,62.76 100.89,61.9 100.89,57.86 101.58,57.17 103.25,57.17 103.33,57.1 103.36,57.14 U2.4
N$44  (via drill 0.6)
  Top 0.406: v24.89,53.85 24.89,55.16 U$8.C1
  Bottom 0.406: U$4.2 49.53,26.29 32.38,43.43 24,43.43 22.73,44.83 22.61,51.69 v24.89,53.85
N$47
  Top 0.406: R27.2 67.79,10.19 70.1,7.87 71.07,7.87 MICROPHONE.1
N$49
  Top 0.305: C29.- 99.39,57.2 100.71,55.88 103.56,55.88 | 103.56,55.88 U2.5 | 103.58,55.85 103.56,55.88
N$51
  Top 0.305: U$14.6 99.99,78.98 101.27,77.7 101.27,77.22 101.7,76.78 103.45,76.78 103.4,76.83 R20.2
PRESSURE
  Top 0.406: R26.1 30.68,19.51 31.75,20.57 31.75,21.59 32.26,22.1 33.1,22.1 R21.1 33.45,21.84 34.8,21.84 36.07,23.11 44.7,23.11 55.88,34.29 55.88,69.34 57.36,70.82 IC1.4
RIGHT  (via drill 0.6)
  Top 0.406: IC1.51 46.53,85.05 v41.99,89.59 | v25.15,38.23 24.77,37.85 13.55,37.85 U$5.6
  Bottom 0.406: v41.99,89.59 41.91,89.59 40.79,90.7 20.14,90.7 | 20.14,90.7 20.07,90.78 | 20.14,90.7 19.48,90.7 17.79,89.01 17.37,88.59 17.02,88.24 17.02,75.56 12.57,71.12 12.57,50.8 17.37,46 17.37,39.78 18.92,38.23 23.37,38.23 23.75,37.85 24.77,37.85 v25.15,38.23
RTC_SCL  (via drill 0.6)
  Top 0.203: v67.11,97.38 67.54,97.81 67.77,98.04 67.84,98.12 75.89,98.12 77.62,96.39 80.24,96.39 | 63.73,88.41 63.73,88.37 | IC1.37 63.73,88.41 | v62.71,93.88 63.73,92.86 63.73,88.41 | 81.89,96.39 U$2.3 80.24,96.39 | 80.24,96.39 80.24,96.37 v79.83,95.96
  Bottom 0.203: v67.11,97.38 67.11,93.5 66.6,92.99 63.6,92.99 v62.71,93.88 | X3.4 96.52,95.81 95.35,96.98 95.35,98.83 94.84,99.34 83.31,99.34 82.91,98.93 82.91,96.75 82.58,96.42 80.29,96.42 v79.83,95.96
RTC_SDA  (via drill 0.6)
  Top 0.203: IC1.36 64.57,88.39 | IC1.36 | v64.08,93.88 64.57,93.4 IC1.36 | v78.03,97.21 78.44,96.79 U$2.2 82.37,96.79 82.42,96.85 82.78,97.1 82.78,98.22 82.45,98.4 v81.86,98.4
  Bottom 0.203: v64.08,93.88 64.49,93.47 66.34,93.47 66.55,93.67 66.55,96.67 66.02,97.21 66.02,98.02 66.29,98.3 68.15,98.3 69.24,97.21 v78.03,97.21 | X3.3 96.52,98.96 95.73,99.75 82.14,99.75 81.28,98.88 81.28,98.5 81.76,98.5 v81.86,98.4
SD2_CD  (via drill 0.6)
  Top 0.203: v89.71,93.29 89.59,93.29 88.21,94.67 83.06,94.67 82.73,94.67 81.84,95.56 U$2.5
  Top 0.254: IC1.47 55.76,85.94 v55.09,85.27 | v73.25,89.08 73.25,93.29 v73.36,93.4 | v83.06,94.26 83.06,94.67
  Bottom 0.203: X3.13 109.09,97.79 107.87,96.57 107.87,94.41 106.22,92.76 90.25,92.76 v89.71,93.29
  Bottom 0.254: v55.09,85.27 59.28,85.27 60.58,83.97 68.15,83.97 v73.25,89.08 | v73.36,93.4 82.19,93.4 v83.06,94.26
SD2_CLK  (via drill 0.6)
  Top 0.203: 89.36,94.97 89.18,95.15 | v89.53,94.79 89.36,94.97 | U$2.6 88.73,95.59 89.36,94.97 | IC1.43 58.96,90.39 58.95,90.42 58.19,91.82 v57.86,92.3
  Bottom 0.203: X3.12 106.68,95.17 104.72,93.17 91.11,93.17 v89.53,94.79 87.02,94.79 83.24,91.01 61.24,91.01 60.33,90.09 59.31,90.09 58.83,90.58 58.12,91.95 57.96,92.15 v57.86,92.3
SD2_CS  (via drill 0.6)
  Top 0.203: 85.27,96.79 U$2.9 | 85.27,96.79 93.38,96.79 93.5,96.67 99.75,96.67 100.13,97.21 100.13,99.08 101.09,99.9 102.82,99.9 X3.9 104.17,97.77 | IC1.40 61.36,92.16 v60.48,93.83 | v86,97.66 85.27,97.16 85.27,96.79
  Bottom 0.203: v60.48,93.83 61.21,92.43 82.53,92.43 85.27,95.17 85.27,97.18 v86,97.66
SD2_MISO  (via drill 0.6)
  Top 0.203: v91.34,94.31 91.16,94.31 90.04,95.43 | 90.04,95.43 89.86,95.61 | U$2.7 89.48,95.99 90.04,95.43 | IC1.42 59.76,90.56 59.74,90.58 58.8,92.76 57.91,93.65 v57.53,93.65
  Bottom 0.203: X3.11 106.68,97.54 105.39,96.24 105.39,94.59 104.34,93.55 92.1,93.57 v91.34,94.31 91.34,94.34 89.81,95.86 86.59,95.86 86.16,95.43 86.16,94.64 83.01,91.49 61.01,91.49 60.25,90.73 59.84,90.73 58.88,91.69 58.88,92.69 57.91,93.65 v57.53,93.65
SD2_MOSI  (via drill 0.6)
  Top 0.203: v91.21,95.78 90.75,96.22 90.6,96.39 U$2.8 | IC1.41 60.56,92.12 v59.18,93.75
  Bottom 0.203: X3.10 103.61,95.25 102.41,94.06 92.81,94.06 v91.21,95.78 91.24,95.78 | v59.18,93.75 59.74,91.97 62.59,91.95 82.7,91.95 85.75,95 85.75,95.73 86.44,96.42 90.6,96.42 91.24,95.78 | 91.24,95.78 91.29,95.73
SD_CD  (via drill 0.6)
  Top 0.254: IC1.46 56.56,89.31 v55.78,90.09 | v69.27,90.22 70.69,90.22 v73.33,87.58 | 111.53,75.67 111.58,75.62 | 111.53,75.67 U1.CD1 | v109.14,76.25 110.95,76.25 111.53,75.67
  Bottom 0.254: v55.78,90.09 58.19,90.09 58.78,89.51 68.66,89.59 v69.27,90.22 | v73.33,87.58 74.68,87.58 78.54,83.72 78.54,82.88 84.73,76.68 108.71,76.68 v109.14,76.25
SD_CLK  (via drill 0.6)
  Top 0.254: U1.5 120.2,78.2 116.99,81.41 116.99,85.5 v113.69,88.8 | v85.62,88.77 83.87,88.77 v82.37,90.22 | v65.63,85.85 66.95,87.63 66.95,88.32 IC1.33
  Bottom 0.254: v113.69,88.8 85.65,88.8 v85.62,88.77 | v82.37,90.22 70.54,90.27 v65.63,85.85
SD_CS  (via drill 0.6)
  Top 0.254: U1.2 119.9,81.5 118.75,82.65 118.75,87.99 v115.44,91.29 | v80.42,86.67 75.97,86.67 74.35,85.04 69.27,85.04 69.22,84.99 69.16,85.05 IC1.30
  Bottom 0.254: v115.44,91.29 85.04,91.29 v80.42,86.67
SD_GREEN  (via drill 0.6)
  Top 0.254: R9.1 30.39,59.32 v31.39,60.33 | 62.13,72.95 62.16,72.92 IC1.10 | v61.87,71.2 62.13,72.95 | 62.13,72.95 62,73.08
  Bottom 0.254: v31.39,60.33 31.39,61.47 39.78,69.85 57.43,69.85 58.47,70.89 61.7,70.89 v61.87,71.2
SD_MISO  (via drill 0.6)
  Top 0.254: IC1.32 73.64,86.64 75.79,88.8 82.42,88.8 v84.05,87.17 | v117.5,90.96 122.25,90.96 124.13,89.08 124.13,77.11 123.01,76 121.61,76 | 121.61,76 121.62,76 U1.7 | 121.61,76 121.56,75.95
  Bottom 0.254: v84.05,87.17 85.95,87.17 86.72,87.94 111.68,87.94 111.84,87.78 114.33,87.78 v117.5,90.96
SD_MOSI  (via drill 0.6)
  Top 0.254: U1.3 119.98,80.4 118.01,82.37 118.01,86.67 v114.71,89.97 | v82.19,87.07 81.66,87.07 80.87,87.86 75.95,87.86 73.94,85.85 68.53,85.85 68.52,85.84 | 68.52,85.84 68.48,85.8 | 68.52,85.84 IC1.31
  Bottom 0.254: v114.71,89.97 85.09,89.97 v82.19,87.07
SD_RED  (via drill 0.6)
  Top 0.254: R8.1 36.99,59.88 v36.14,60.73 | 62.96,72.87 62.97,72.87 | 62.96,72.87 IC1.11 | v62.71,68.63 62.89,72.8 62.96,72.87
  Bottom 0.254: v36.14,60.73 36.14,62.28 40.87,67 61.27,67 v62.71,68.63
SELECT  (via drill 0.6)
  Top 0.254: v35.13,83.39 38.89,83.39 39.75,84.25 44.63,84.25 45.82,83.06 51.79,83.06 52.27,82.58 53.03,82.58 53.1,82.64 IC1.54
  Top 0.406: U$5.5 23.32,39.8 v24,39.12
  Bottom 0.406: v35.13,83.39 28.68,89.84 19.96,89.84 17.65,87.53 17.65,75.31 13.21,70.87 13.21,51.18 18.03,46.35 18.03,40.13 19.05,39.12 v24,39.12
TEMP  (via drill 0.6)
  Top 0.406: IC1.3 56.56,71.04 55.88,70.36 43.18,70.36 42.42,69.6 39.12,69.6 27.94,58.42 27.94,58.17 v27.69,57.91 | R31.1 R32.1 24,19.81 v25.4,21.21
  Bottom 0.406: v27.69,57.91 27.18,57.91 21.59,52.32 21.59,42.55 21.97,42.16 31.88,42.16 35.81,38.23 35.81,27.18 29.84,21.21 v25.4,21.21
THERMISTOR_(0-50C)
  Top 0.203: R5.1 103.43,87.15 102.89,87.68 102.89,98.48 102.26,99.11 100.97,99.11 100.51,98.65 100.51,96.27 99.49,95.25 X3.6 98.45,95.25 97.1,93.9 97.1,93.27 95.99,92.15 83.46,92.15 80.86,94.75 | 80.86,94.75 80.82,94.79 | U$2.4 81.08,95.99 80.82,95.73 80.82,94.82 80.87,94.77 80.86,94.75
  Top 0.305: 103.43,81.97 103.45,81.94 | 103.43,81.97 R11.2 | R5.1 103.35,82.04 103.43,81.97
UP  (via drill 0.6)
  Top 0.406: IC1.48 48.72,88.44 v42.16,95 | v24.64,35.56 24.59,35.51 U$5.3
  Bottom 0.406: v42.16,95 42.14,95 40.44,93.29 18.36,93.29 14.48,89.41 14.48,76.33 10.29,72.14 10.29,49.66 14.58,45.36 14.58,39.01 20.7,32.89 24.13,32.89 24.51,32.51 25.65,32.51 26.04,32.89 26.04,34.67 25.15,35.56 v24.64,35.56
V+
  Top 0.305: D1.1 104.39,21.44 104.42,21.44 104.42,21.13
  Top 0.61: D2.1 104.37,26.34 104.32,26.29 104.37,26.24 D1.1 | 104.42,21.13 98.6,21.13 93.85,16.38 MCP1826S.IN 93.73,10.29 93.73,7.37 95.12,5.97 C13.+
V_IN
  Top 0.61: C12.+ 108.15,16.51 | C12.+ J1.PWR | C12.+ 108.36,16.51 108.79,16.94 D1.2
V_USB
  Top 0.61: FER.2 105.84,31.74 105.84,29.77 108.89,26.72 108.89,26.49 108.86,26.49 D2.2
VBAT
  Top 0.305: 101.47,82.7 101.47,82.65 101.21,82.92 U$14.10 | 101.47,82.7 101.47,82.73 | 101.47,82.7 101.52,82.7 101.24,82.42 U$14.9
  Top 0.61: X3.8 101.6,95.22 | X3.8 X3.7 | X3.8 101.6,82.86 101.47,82.73
VCC  (via drill 0.6)
  Top 0.203: 79.83,97.48 80.12,97.19 U$2.1 81.34,97.19 v80.59,97.94 | LIGHT.B2 57.91,6.35 57.15,5.59 57.15,2.79 57.91,2.03
  Top 0.254: C25.1 51.56,10.77 51.54,10.74 | C16.1 44.58,84.96 45.97,83.57 52.83,83.57 53.09,83.31 53.16,83.39 IC1.53 | C14.1 66.67,63.19 66.67,70.87 66.14,71.4 66.14,72.86 | 66.14,72.86 66.14,72.92 | 66.14,72.86 IC1.15
  Top 0.305: 107.53,42.41 U3.20 | 107.52,42.42 104.28,45.66 U3.4 102.86,45.66 | 96.39,40.57 96.42,40.54 | 96.39,40.57 C4.1 | 96.39,40.57 96.19,40.77 C3.+ 96.19,47.12 97.64,48.56 100.41,48.56 100.89,48.13 100.89,45.97 101.17,45.64 102.84,45.64 102.86,45.66 | 102.86,45.66 102.87,45.67 | U2.16 110,61.07 109.96,61.11 110.16,61.32 C30.+ | IC1.45 57.36,84.84 56.34,83.46 | IC1.53 55.96,83.44 56.34,83.46 | 56.34,83.46 56.59,83.31 56.59,78.89 56.44,78.79 54.29,77.05 IC1.61 46.77,77.05 44.45,74.73 40.64,74.73 40.53,74.61 C15.1 | R12.1 111.48,12.09 v110.49,13.08
  Top 0.406: 107.53,42.41 107.52,42.42 107.26,42.67 107.26,60.12 108.1,60.96 U2.16 110.21,60.96 111,61.75 v111,62.15 | C23.1 30.35,8.12 29.18,6.96 26.85,6.96 26.84,6.95 | 26.84,6.95 26.8,6.91 | 26.84,6.95 PRESSURE.2 24.77,6.99 TEMPERATURE.1 22.61,3.62 C22.1 | C26.1 80.79,81.73 80.11,81.05 68.61,81.05 | 68.61,81.05 IC1.25 | 35.69,74.78 34.91,74.78 33.02,72.9 33.02,71.75 32,70.74 27.94,70.74 27.43,71.25 | 35.69,74.78 C5.+ 40.53,74.78 40.64,74.68 40.53,74.57 C15.1 40.49,74.57 40.39,74.68 | 59.69,99.06 59.44,98.81 | R17.2 59.69,99.06 | C19.1 59.81,99.18 59.69,99.06 | R17.2 59.69,99.57 | 56.55,94.14 55.27,95.43 55.27,99.34 56.02,100.09 | 56.55,94.14 57.33,94.89 64.69,94.89 65.33,94.26 65.33,88.44 IC1.35 65.36,87.56 64.31,86.51 64.31,84.48 65.73,83.06 65.81,83.06 | 74.72,96.62 C35.1 74.65,96.64 74.65,96.62 | 74.65,96.62 74.72,96.62 | 79.83,97.48 78.72,98.6 v77.57,98.6 | v76.5,96.09 75.97,96.62 74.72,96.62 | 56.55,94.14 55.68,93.27 55.68,91.95 57.4,90.22 57.4,88.47 57.38,88.47 IC1.45 | 65.81,81.03 65.81,75.16 66.17,74.8 66.17,73.03 66.16,73.02 IC1.15 | 65.81,81.03 65.81,83.06 | 65.81,83.06 65.81,84.43 67.54,86.16 67.54,87.12 67.87,87.45 67.87,95.28 69.22,96.62 74.65,96.62 | 65.81,81.03 65.86,81.03 65.89,81.05 68.61,81.05 | C6.+ 47.3,99.39 | C6.+ | U1.4 120.5,79.3 v120.37,79.43 | 56.02,100.09 56.16,100.23 57.61,100.23 58.62,99.21 R17.2 | R17.2 | 48.26,99.39 49.61,99.39 50.39,100.18 55.93,100.18 56.02,100.09 | 48.26,99.39 C6.+ | ISP.2 50.75,96.11 48.95,97.92 48.95,98.7 48.26,99.39 | C14.1 66.81,61.47 66.04,60.71 66.04,57.15 62.53,53.65 | MICROPHONE.4 75.98,8.09 78.23,5.84 78.23,2.79 78.87,2.16
  Top 0.406: 78.87,2.16 78.99,2.03 v95.5,2.03 | 51.54,10.74 R24.2 R23.2 51.54,2.56 52.07,2.03 | 52.07,2.03 57.91,2.03 78.74,2.03 78.87,2.16 | U$3.4 35.62,80.7 34.54,79.63 34.54,75.93 35.69,74.78 | v49.4,53.21 48.26,54.36 48.26,61.21 46.52,62.95 R4.2 46.52,65.37 46.35,65.53 | R25.2 51.66,64.8 50.93,65.53 46.35,65.53 | 46.35,65.53 42.29,65.53 41.53,64.77 41.53,63.4 R22.2 | C22.1 22.61,3.37 | C24.1 9.91,12.7 14.86,7.75 HUMIDITY.V+ 15.24,1.91 22.61,1.91 | 22.61,1.91 51.94,1.91 52.07,2.03 | C22.1 22.48,2.03 22.61,1.91 | R16.2 49.81,15.85 51.56,14.1 C25.1 | 25.43,70.87 25.43,68.92 C32.+ 25.83,63.19 C31.1 | 25.43,70.87 U$1.20 | 27.43,71.25 U$1.21 | 27.43,71.25 27.05,70.87 25.43,70.87
  Top 0.61: 62.18,58.98 62.2,59 U$4.22 | 62.18,58.98 62.31,58.85 62.31,53.87 62.53,53.65 v62.79,53.39 75.86,40.32 89.14,40.32 C11.+ | U$4.23 59.63,59 59.61,58.98 62.18,58.98 | 96.29,46.91 96.22,46.99 C3.+ 94.23,46.99 89.39,42.15 C11.+ | C11.+ 89.39,34.67 C10.1 89.71,25.7 v87.63,23.62 | MCP1826S.OUT 99.44,10.92 C27.+
  Bottom 0.305: v110.49,13.08 101.6,13.08 MCP1826S.OUT 98.81,10.29
  Bottom 0.406: v77.57,98.6 78.72,98.6 79.3,98.02 79.3,96.75 77.98,95.43 77.17,95.43 v76.5,96.09 | v80.59,97.94 80.59,99.14 81.81,100.36 96.52,100.36 99.06,97.81 X3.5 | v120.37,79.43 120.37,73.81 115.72,69.16 115.72,65.05 114.43,63.75 112.6,63.75 v111,62.15 | v49.4,53.21 62.61,53.21 v62.79,53.39 | v95.5,2.03 95.5,4.7 98.81,8 98.81,10.29
  Bottom 0.61: v87.63,23.62 88.27,23.62 98.81,13.08 98.81,10.54 MCP1826S.OUT
VIN
  Top 0.305: C20.+ 94.79,76.83 93.47,78.16 93.47,82.02 93.7,82.25 | 93.7,82.25 94.21,82.75 | 94.21,82.75 94.31,82.86 | U$14.1 94.37,82.92 94.21,82.75 | U$14.2 93.87,82.42 93.7,82.25
WIFI_CONNECTED
  Top 0.406: R30.2 8.42,86.68 LED1.A 8.54,84.07 9.4,84.07 11.05,85.72 22.23,85.72 23.21,86.71 U$1.29
WIFI_CTS  (via drill 0.6)
  Top 0.254: IC1.26 68.82,81.79 74.42,81.79 74.93,82.3 v75.06,82.3
  Top 0.406: v33.15,77.6 33.02,77.6 32.89,77.72 13.84,77.72 12.83,78.74 11.96,78.74 U$1.11
  Bottom 0.406: v75.06,82.3 74.3,81.53 63.37,81.53 55.12,73.28 45.09,73.28 42.55,75.82 34.92,75.82 v33.15,77.6
WIFI_GREEN  (via drill 0.6)
  Top 0.254: R7.1 35.89,55.24 v35.15,55.98 | v59.16,67.92 59.38,68.17 58.93,68.66 58.93,72.69 58.98,72.75 58.96,72.76 IC1.6
  Bottom 0.254: v35.15,55.98 35.15,62.05 40.66,67.56 58.75,67.56 v59.16,67.92
WIFI_RED  (via drill 0.6)
  Top 0.254: R6.1 36.99,52.39 v36.02,53.37 | v60.3,68.5 59.74,69.14 59.74,72.67 59.69,72.72 59.76,72.79 IC1.7
  Bottom 0.254: v36.02,53.37 35.97,53.37 33.93,55.4 33.93,61.65 40.44,68.15 58.22,68.17 59.26,69.24 59.97,69.24 60.5,68.71 v60.3,68.5
WIFI_RTS  (via drill 0.6)
  Top 0.254: v73.15,82.68 73.12,82.64 IC1.27
  Top 0.406: U$1.10 25.72,80.71 26.8,81.79 32.64,81.79 v33.02,81.41
  Bottom 0.406: v33.02,81.41 33.02,78.99 35.43,76.58 42.8,76.58 45.34,74.04 54.74,74.04 63.37,82.68 v73.15,82.68
WIFI_RX  (via drill 0.6)
  Top 0.203: IC1.38 63.02,88.39 | IC1.38 | IC1.38 62.94,88.47
  Top 0.254: U$1.13 10.74,74.71 v10.03,75.41
  Top 0.406: v42.06,96.8 42.22,96.8 v48.51,90.5 | 62.97,88.45 62.97,88.52 | 62.97,88.45 IC1.38 | v62.48,85.7 62.97,86.18 62.97,88.45
  Bottom 0.406: v10.03,75.41 12.47,75.41 13.82,76.76 13.82,90.02 18.06,94.26 39.52,94.26 v42.06,96.8 | v48.51,90.5 51.26,90.5 55.35,86.41 59.69,86.41 60.96,85.14 61.92,85.14 v62.48,85.7
WIFI_TX  (via drill 0.6)
  Top 0.406: U$1.12 10.67,76.71 v10.03,77.34 | v42.01,98.68 42.01,98.5 48.74,91.77 v49.78,91.77 | v61.06,86.46 61.77,86.46 62.15,86.84 62.15,88.39 62.2,88.44 IC1.39
  Bottom 0.406: v10.03,77.34 12.47,77.34 13.16,78.03 13.16,90.4 17.8,95.05 38.38,95.05 v42.01,98.68 | v49.78,91.77 51.03,91.77 55.65,87.15 60.38,87.15 v61.06,86.46

### Text on the board
Dimension: Base Station V2 | Joshua Schapiro | December 13, 2010
Reference: 1 | 14